# Altium project CAMERA.PrjPcb (part 2 of 3)

## Sheet SDMMC RV1126B.SchDoc: SDMMC0
size A4; DrawnBy: ThanhQuoc; Revision: V01; SheetNumber: 11; SheetTotal: 21; Project: RV1126 CAMERA BOARD DESIGN
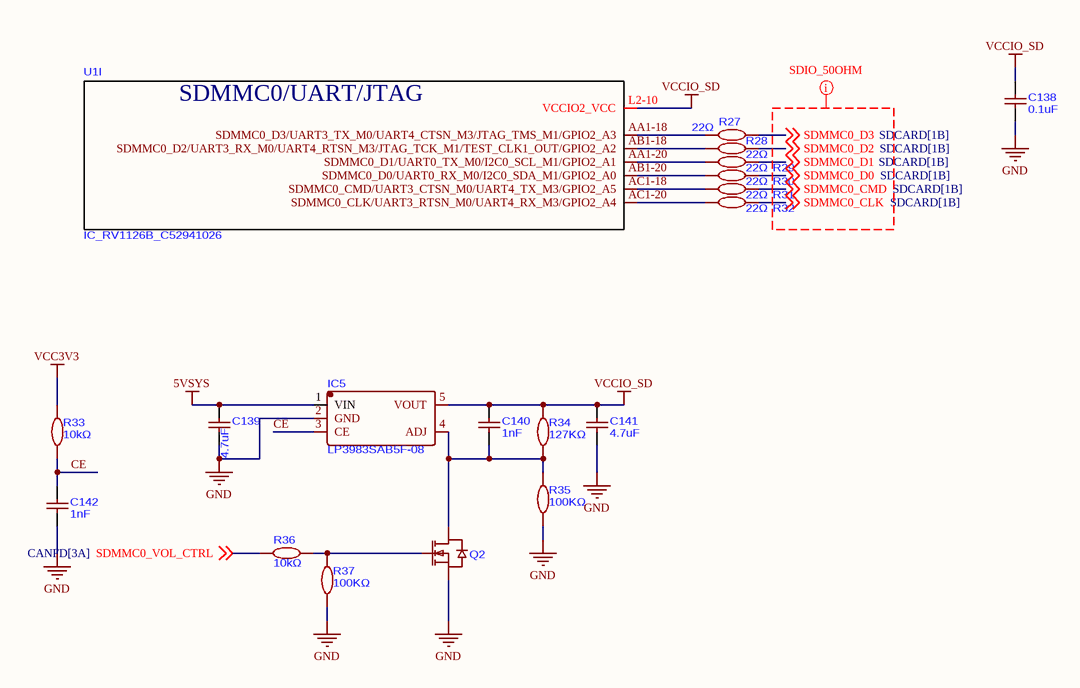
[diagram p10: SDMMC RV1126B.SchDoc]

### Parts
C138  0.1uF  [C0201]
C139  4.7uF  [C0402]
C140  1nF  [C0201]
C141  4.7uF  [C0402]
C142  1nF  [C0201]
IC5  LP3983SAB5F-08  [SOT-23-5_L3.0-W1.7-P0.95-LS2.8-BR]
Q2  N-CHANEL  [SOT-23-3_L2.9-W1.3-P1.90-LS2.4-BR]  (value not drawn)
R27  22Ω  [R0201]
R28  22Ω  [R0201]
R29  22Ω  [R0201]
R30  22Ω  [R0201]
R31  22Ω  [R0201]
R32  22Ω  [R0201]
R33  10kΩ  [R0201]
R34  127KΩ  [R0201]
R35  100KΩ  [R0201]
R36  10kΩ  [R0201]
R37  100KΩ  [R0201]
U1  IC_RV1126B_C52941026  [CCSP-491_L14.0-W14.0-TL_RV1126B]  (part I of 18)

### Nets
5VSYS: C139.2 IC5.1(VIN)
GND: C138.2 C139.1 C141.2 C142.1 IC5.2(GND) Q2.2(S) R35.1 R37.1
VCC3V3: R33.1
VCCIO_SD: C138.1 C140.2 C141.1 IC5.5(VOUT) R34.2 U1.L2-10(VCCIO2_VCC)
CE: C142.2 IC5.3(CE) R33.2
SDMMC0_CLK: R32.2 ; off-sheet SDMMC0_CLK
SDMMC0_CMD: R31.2 ; off-sheet SDMMC0_CMD
SDMMC0_D0: R30.2 ; off-sheet SDMMC0_D0
SDMMC0_D1: R29.2 ; off-sheet SDMMC0_D1
SDMMC0_D2: R28.2 ; off-sheet SDMMC0_D2
SDMMC0_D3: R27.2 ; off-sheet SDMMC0_D3
SDMMC0_VOL_CTRL: R36.1 ; off-sheet SDMMC0_VOL_CTRL
NetC140_1: C140.1 IC5.4(ADJ) Q2.3(D) R34.1 R35.2
NetQ2_1: Q2.1(G) R36.2 R37.2
NetR27_1: R27.1 U1.AA1-18(SDMMC0_D3/UART3_TX_M0/UART4_CTSN_M3/JTAG_TMS_M1/GPIO2_A3)
NetR28_1: R28.1 U1.AB1-18(SDMMC0_D2/UART3_RX_M0/UART4_RTSN_M3/JTAG_TCK_M1/TEST_CLK1_OUT/GPIO2_A2)
NetR29_1: R29.1 U1.AA1-20(SDMMC0_D1/UART0_TX_M0/I2C0_SCL_M1/GPIO2_A1)
NetR30_1: R30.1 U1.AB1-20(SDMMC0_D0/UART0_RX_M0/I2C0_SDA_M1/GPIO2_A0)
NetR31_1: R31.1 U1.AC1-18(SDMMC0_CMD/UART3_CTSN_M0/UART4_TX_M3/GPIO2_A5)
NetR32_1: R32.1 U1.AC1-20(SDMMC0_CLK/UART3_RTSN_M0/UART4_RX_M3/GPIO2_A4)

### Layout directives
net class SDIO_50OHM: SDMMC0_CLK, SDMMC0_CMD, SDMMC0_D0, SDMMC0_D1, SDMMC0_D2, SDMMC0_D3

### Notes on the sheet
- Title:
- Drawn By:
- Page Contents:
- Checked By:
- Size:
- Date:
- File:
- License:
- Email:
- A4
- nguyenthanhquoc0206@gmail.com
- Number:
- Time:
- Revision:
- Sheet
- Website:
- of
- https://www.facebook.com/ntq.687
- (in symbol IC_RV1126B_C52941026, part I) SDMMC0/UART/JTAG

### Library data of the parts
C138 = CAP_100nF-6.3V-10%-0201_1: as C42 on sheet Power Pins Page RV1126
C139 C141 = CAP_4.7uF-16V-10%-0402: 4.7uF ±10% 16V Ceramic Capacitor X5R 0402
C140 C142 = CAP_1nF-50V-10%-0201: CAP CER 1nF 50V X7R 0201
IC5 = LP3983SAB5F-08: 300mA, Ultra-low noise, Small Package Ultra-Fast CMOS LDO Regulator; ComponentLink1Description: LCSC; ComponentLink1URL: https://www.lcsc.com/product-detail/C324567.html?s_z=n_q_LP3983SAB5F-08&spm=wm.fly.bg.0.xh&lcsc_vid=EwRWBFZSQVIPVFdUTlJfVldeFFRYUFQAElRYBFRRE1MxVlNeRVlfX1BQRFFcUTsOAxUeFF5JWBYZEEoKFBINSQcJGk4dAgUUFAk%3D
Q2 = JSM2302A-A2SHB: MOSFET N-CH 20V 3A SOT-23
R27-R32 = RES_22-50mW-1%-0201: RES 22Ω ±1% 50mW 0201; ComponentLink1Description: LCSC; ComponentLink1URL: https://www.lcsc.com/product-detail/C295718.html?s_z=n_q_t_120%2520OHM&spm=wm.fly.bg.5.xh___wm.ssy.tc.1.tz&lcsc_vid=EwRWBFZSQVIPVFdUTlJfVldeFFRYUFQAElRYBFRRE1MxVlNeRFZeU1BfTlBYVzsOAxUeFF5JWBYZEEoKFBINSQcJGk4eFQsCAgIaSgADAwAHC0slRVhcV1ZTT08GEwkK
R33 R36 = RES_10K-50mW-1%-0201: RES 10KΩ ±1% 50mW 0201; ComponentLink1Description: LCSC; ComponentLink1URL: https://www.lcsc.com/product-detail/C93949.html?spm=wm.fly.bg.0.xh&lcsc_vid=EwRWBFZSQVIPVFdUTlJfVldeFFRYUFQAElRYBFRRE1MxVlNeRVlXUFNQQ1RWXjsOAxUeFF5JWBYZEEoKFBINSQcJGk4eFQsCAgIaSgADAwAHC0slRlVYUFFIHxUDCw%3D%3D
R34 = RES_127K-50mW-1%-0201: RES 127kΩ ±1% 50mW 0201; ComponentLink1Description: LCSC; ComponentLink1URL: https://www.lcsc.com/product-detail/C295718.html?s_z=n_q_t_120%2520OHM&spm=wm.fly.bg.5.xh___wm.ssy.tc.1.tz&lcsc_vid=EwRWBFZSQVIPVFdUTlJfVldeFFRYUFQAElRYBFRRE1MxVlNeRFZeU1BfTlBYVzsOAxUeFF5JWBYZEEoKFBINSQcJGk4eFQsCAgIaSgADAwAHC0slRVhcV1ZTT08GEwkK
R35 = RES_100K-50mW-1%-0201: RES 100kΩ ±1% 50mW 0201; ComponentLink1Description: LCSC; ComponentLink1URL: https://www.lcsc.com/product-detail/C295718.html?s_z=n_q_t_120%2520OHM&spm=wm.fly.bg.5.xh___wm.ssy.tc.1.tz&lcsc_vid=EwRWBFZSQVIPVFdUTlJfVldeFFRYUFQAElRYBFRRE1MxVlNeRFZeU1BfTlBYVzsOAxUeFF5JWBYZEEoKFBINSQcJGk4eFQsCAgIaSgADAwAHC0slRVhcV1ZTT08GEwkK
R37 = RES_47K-50mW-1%-0201: 47kΩ 50mW 25V Thick Film Resistor ±1% ±200ppm/℃ 0201 Chip Resistor - Surface Mount RoHS; ComponentLink1Description: LCSC; ComponentLink1URL: https://www.lcsc.com/product-detail/C295718.html?s_z=n_q_t_120%2520OHM&spm=wm.fly.bg.5.xh___wm.ssy.tc.1.tz&lcsc_vid=EwRWBFZSQVIPVFdUTlJfVldeFFRYUFQAElRYBFRRE1MxVlNeRFZeU1BfTlBYVzsOAxUeFF5JWBYZEEoKFBINSQcJGk4eFQsCAgIaSgADAwAHC0slRVhcV1ZTT08GEwkK

## Sheet SDCARD.SchDoc: SD CARD NO BOOT
size A4; DrawnBy: ThanhQuoc; Revision: V01; SheetNumber: 12; SheetTotal: 21; Project: RV1126 CAMERA BOARD DESIGN
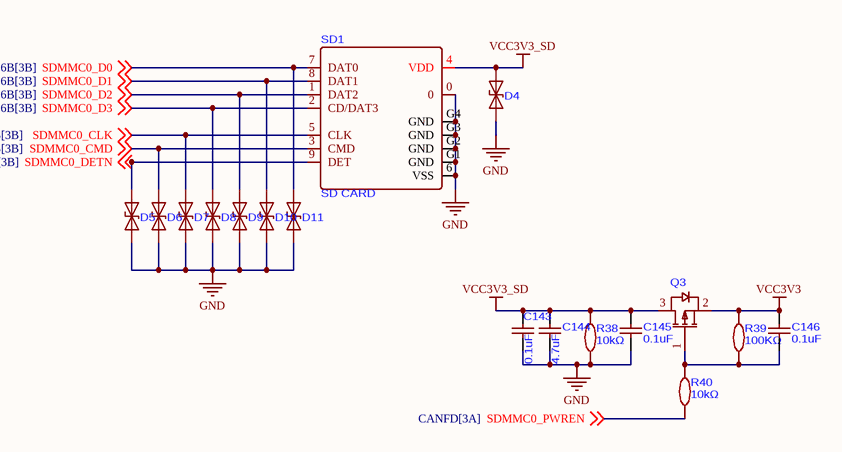
[diagram p11: SDCARD.SchDoc]

### Parts
C143  0.1uF  [C0201]
C144  4.7uF  [C0402]
C145  0.1uF  [C0201]
C146  0.1uF  [C0201]
D4  ESD DIODE  [DSN0603-2_L0.7-W0.3-P0.40-BI]  (value not drawn)
D5  ESD DIODE  [DSN0603-2_L0.7-W0.3-P0.40-BI]  (value not drawn)
D6  ESD DIODE  [DSN0603-2_L0.7-W0.3-P0.40-BI]  (value not drawn)
D7  ESD DIODE  [DSN0603-2_L0.7-W0.3-P0.40-BI]  (value not drawn)
D8  ESD DIODE  [DSN0603-2_L0.7-W0.3-P0.40-BI]  (value not drawn)
D9  ESD DIODE  [DSN0603-2_L0.7-W0.3-P0.40-BI]  (value not drawn)
D10  ESD DIODE  [DSN0603-2_L0.7-W0.3-P0.40-BI]  (value not drawn)
D11  ESD DIODE  [DSN0603-2_L0.7-W0.3-P0.40-BI]  (value not drawn)
Q3  P-CHANNEL  [SOT-23-3_L2.9-W1.3-P1.90-LS2.4-BR]  (value not drawn)
R38  10kΩ  [R0201]
R39  100KΩ  [R0201]
R40  10kΩ  [R0201]
SD1  SD CARD  [CONN-SMD_1051620101]

### Nets
GND: C143.1 C144.1 C145.1 D4.1(K) D5.1(K) D6.1(K) D7.1(K) D8.1(K) D9.1(K) D10.1(K) D11.1(K) R38.1 SD1.0 SD1.6(VSS) SD1.G1(GND) SD1.G2(GND) SD1.G3(GND) SD1.G4(GND)
VCC3V3: C146.2 Q3.2(S) R39.2
VCC3V3_SD: C143.2 C144.2 C145.2 D4.2(A) Q3.3(D) R38.2 SD1.4(VDD)
SDMMC0_CLK: D7.2(A) SD1.5(CLK) ; off-sheet SDMMC0_CLK
SDMMC0_CMD: D6.2(A) SD1.3(CMD) ; off-sheet SDMMC0_CMD
SDMMC0_D0: D11.2(A) SD1.7(DAT0) ; off-sheet SDMMC0_D0
SDMMC0_D1: D10.2(A) SD1.8(DAT1) ; off-sheet SDMMC0_D1
SDMMC0_D2: D9.2(A) SD1.1(DAT2) ; off-sheet SDMMC0_D2
SDMMC0_D3: D8.2(A) SD1.2(CD/DAT3) ; off-sheet SDMMC0_D3
SDMMC0_DETN: D5.2(A) SD1.9(DET) ; off-sheet SDMMC0_DETN
SDMMC0_PWREN: R40.1 ; off-sheet SDMMC0_PWREN
NetC146_1: C146.1 Q3.1(G) R39.1 R40.2

### Notes on the sheet
- Title:
- Drawn By:
- Page Contents:
- Checked By:
- Size:
- Date:
- File:
- License:
- Email:
- A4
- nguyenthanhquoc0206@gmail.com
- Number:
- Time:
- Revision:
- Sheet
- Website:
- of
- https://www.facebook.com/ntq.687

### Library data of the parts
C143 C145 C146 = CAP_100nF-6.3V-10%-0201_1: as C42 on sheet Power Pins Page RV1126
C144 = CAP_4.7uF-16V-10%-0402: as C139 on sheet SDMMC RV1126B
D4-D11 = PESD5V0H1BSFYL: ESD DIODE 5VWM 5VC DSN0603-2 0.13PF
Q3 = WPM3407-3/TR: MOSFET P-CH 30V 4.4A SOT-23
R38 R40 = RES_10K-50mW-1%-0201: RES 10KΩ ±1% 50mW 0201; ComponentLink1Description: LCSC; ComponentLink1URL: https://www.lcsc.com/product-detail/C93949.html?spm=wm.fly.bg.0.xh&lcsc_vid=EwRWBFZSQVIPVFdUTlJfVldeFFRYUFQAElRYBFRRE1MxVlNeRVlXUFNQQ1RWXjsOAxUeFF5JWBYZEEoKFBINSQcJGk4eFQsCAgIaSgADAwAHC0slRlVYUFFIHxUDCw%3D%3D
R39 = RES_100K-50mW-1%-0201: RES 100kΩ ±1% 50mW 0201; ComponentLink1Description: LCSC; ComponentLink1URL: https://www.lcsc.com/product-detail/C295718.html?s_z=n_q_t_120%2520OHM&spm=wm.fly.bg.5.xh___wm.ssy.tc.1.tz&lcsc_vid=EwRWBFZSQVIPVFdUTlJfVldeFFRYUFQAElRYBFRRE1MxVlNeRFZeU1BfTlBYVzsOAxUeFF5JWBYZEEoKFBINSQcJGk4eFQsCAgIaSgADAwAHC0slRVhcV1ZTT08GEwkK
SD1 = 1051620001: CONN MICRO SD CARD (TF CARD)

## Sheet SDMMC1.SchDoc: SDMMC1
size A4; DrawnBy: ThanhQuoc; Revision: V01; SheetNumber: 13; SheetTotal: 21; Project: RV1126 CAMERA BOARD DESIGN
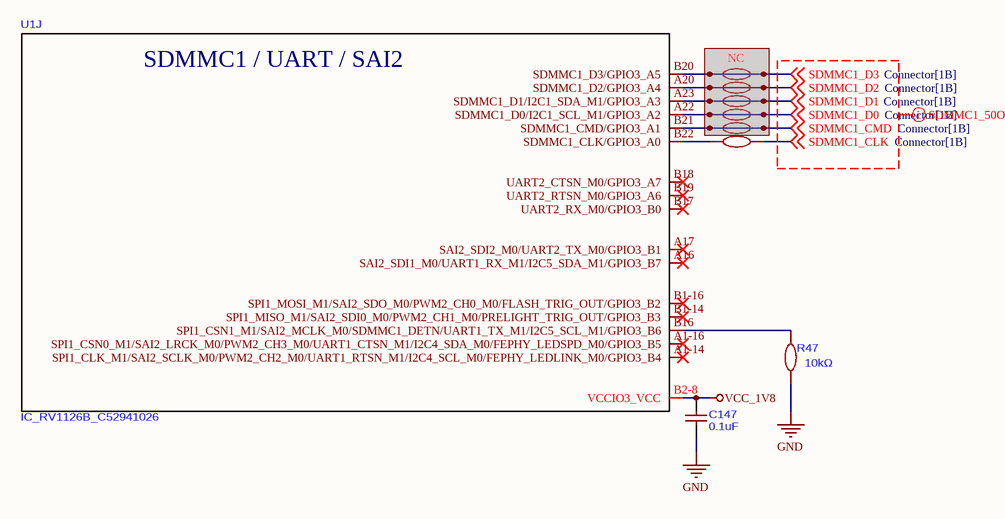
[diagram p12: SDMMC1.SchDoc]

### Parts
C147  0.1uF  [C0201]
R41  22Ω  [R0201]  (value not drawn)  (masked out: inside a compile mask, not in the netlist)
R42  22Ω  [R0201]  (value not drawn)  (masked out: inside a compile mask, not in the netlist)
R43  22Ω  [R0201]  (value not drawn)  (masked out: inside a compile mask, not in the netlist)
R44  22Ω  [R0201]  (value not drawn)  (masked out: inside a compile mask, not in the netlist)
R45  22Ω  [R0201]  (value not drawn)  (masked out: inside a compile mask, not in the netlist)
R46  22Ω  [R0201]  (value not drawn)
R47  10kΩ  [R0201]
U1  IC_RV1126B_C52941026  [CCSP-491_L14.0-W14.0-TL_RV1126B]  (part J of 18)

### Nets
GND: C147.1 R47.1
VCC_1V8: C147.2 U1.B2-8(VCCIO3_VCC)
SDMMC1_CLK: R46.2 ; off-sheet SDMMC1_CLK
NetR46_1: R46.1 U1.B22(SDMMC1_CLK/GPIO3_A0)
NetR47_2: R47.2 U1.B16(SPI1_CSN1_M1/SAI2_MCLK_M0/SDMMC1_DETN/UART1_TX_M1/I2C5_SCL_M1/GPIO3_B6)

Not connected (* = marked no-connect by the designer): U1 A1-14(SPI1_CLK_M1/SAI2_SCLK_M0/PWM2_CH2_M0/UART1_RTSN_M1/I2C4_SCL_M0/FEPHY_LEDLINK_M0/GPIO3_B4)* A1-16(SPI1_CSN0_M1/SAI2_LRCK_M0/PWM2_CH3_M0/UART1_CTSN_M1/I2C4_SDA_M0/FEPHY_LEDSPD_M0/GPIO3_B5)* A16(SAI2_SDI1_M0/UART1_RX_M1/I2C5_SDA_M1/GPIO3_B7)* A17(SAI2_SDI2_M0/UART2_TX_M0/GPIO3_B1)* A20(SDMMC1_D2/GPIO3_A4) A22(SDMMC1_D0/I2C1_SCL_M1/GPIO3_A2) A23(SDMMC1_D1/I2C1_SDA_M1/GPIO3_A3) B1-14(SPI1_MISO_M1/SAI2_SDI0_M0/PWM2_CH1_M0/PRELIGHT_TRIG_OUT/GPIO3_B3)* B1-16(SPI1_MOSI_M1/SAI2_SDO_M0/PWM2_CH0_M0/FLASH_TRIG_OUT/GPIO3_B2)* B17(UART2_RX_M0/GPIO3_B0)* B18(UART2_CTSN_M0/GPIO3_A7)* B19(UART2_RTSN_M0/GPIO3_A6)* B20(SDMMC1_D3/GPIO3_A5) B21(SDMMC1_CMD/GPIO3_A1)

### Layout directives
net class SDMMC1_50OHM: SDMMC1_CLK, SDMMC1_CMD, SDMMC1_D0, SDMMC1_D1, SDMMC1_D2, SDMMC1_D3

### Notes on the sheet
- (near R41) NC
- Title:
- Drawn By:
- Page Contents:
- Checked By:
- Size:
- Date:
- File:
- License:
- Email:
- A4
- nguyenthanhquoc0206@gmail.com
- Number:
- Time:
- Revision:
- Sheet
- Website:
- of
- https://www.facebook.com/ntq.687
- (in symbol IC_RV1126B_C52941026, part J) SDMMC1 / UART / SAI2

### Library data of the parts
C147 = CAP_100nF-6.3V-10%-0201_1: as C42 on sheet Power Pins Page RV1126
R41-R46 = RES_22-50mW-1%-0201: RES 22Ω ±1% 50mW 0201; ComponentLink1Description: LCSC; ComponentLink1URL: https://www.lcsc.com/product-detail/C295718.html?s_z=n_q_t_120%2520OHM&spm=wm.fly.bg.5.xh___wm.ssy.tc.1.tz&lcsc_vid=EwRWBFZSQVIPVFdUTlJfVldeFFRYUFQAElRYBFRRE1MxVlNeRFZeU1BfTlBYVzsOAxUeFF5JWBYZEEoKFBINSQcJGk4eFQsCAgIaSgADAwAHC0slRVhcV1ZTT08GEwkK
R47 = RES_10K-50mW-1%-0201: RES 10KΩ ±1% 50mW 0201; ComponentLink1Description: LCSC; ComponentLink1URL: https://www.lcsc.com/product-detail/C93949.html?spm=wm.fly.bg.0.xh&lcsc_vid=EwRWBFZSQVIPVFdUTlJfVldeFFRYUFQAElRYBFRRE1MxVlNeRVlXUFNQQ1RWXjsOAxUeFF5JWBYZEEoKFBINSQcJGk4eFQsCAgIaSgADAwAHC0slRlVYUFFIHxUDCw%3D%3D

## Sheet SARADC.SchDoc: SARADC
size A4; DrawnBy: ThanhQuoc; Revision: V01; SheetNumber: 14; SheetTotal: 21; Project: RV1126 CAMERA BOARD DESIGN; SPICEModelCacheTSUQRNIG: <root> / <DocumentId>TSUQRNIG</DocumentId> / <CacheFrame Number="0"> / <Model Name="fb_220_adv" Kind="CKT"> / <Text>.SUBCKT FB_220_ADV 1 2 / Rdc 1 2 0.045 / * low freq inductive / L1 1 3 50n / R1 3 2 1 / * high freq loss / R2 1 2 200 / Cpar 1 2 2p / .ends FB_220_ADV</Text> / </Model> / </CacheFrame> / </root>
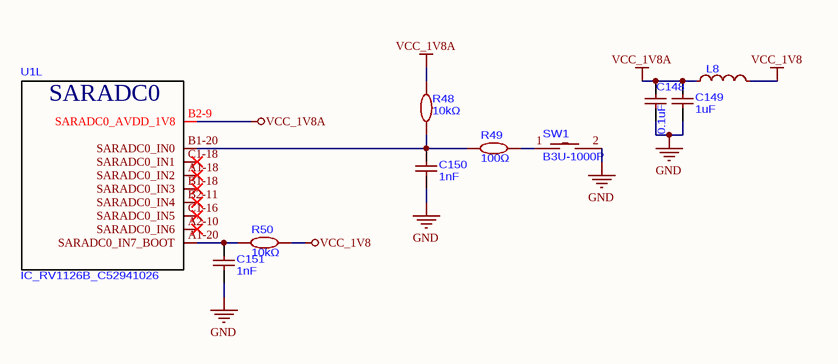
[diagram p13: SARADC.SchDoc]

### Parts
C148  0.1uF  [C0201]
C149  1uF  [C0201]
C150  1nF  [C0201]
C151  1nF  [C0201]
L8  FERRITE BEAD 120Ω 0201 1LN  [R0201]  (value not drawn)
R48  10kΩ  [R0201]
R49  100Ω  [R0201]
R50  10kΩ  [R0201]
SW1  B3U-1000P  [KEY-SMD_B3U-1000PM]
U1  IC_RV1126B_C52941026  [CCSP-491_L14.0-W14.0-TL_RV1126B]  (part L of 18)

### Nets
GND: C148.1 C149.2 C150.1 C151.1 SW1.2
VCC_1V8: L8.2 R50.1
VCC_1V8A: C148.2 C149.1 L8.1 R48.2 U1.B2-9(SARADC0_AVDD_1V8)
NetC150_2: C150.2 R48.1 R49.1 U1.B1-20(SARADC0_IN0)
NetC151_2: C151.2 R50.2 U1.A1-20(SARADC0_IN7_BOOT)
NetR49_2: R49.2 SW1.1

Not connected (* = marked no-connect by the designer): U1 A1-18(SARADC0_IN2)* A2-10(SARADC0_IN6)* B1-18(SARADC0_IN3)* B2-11(SARADC0_IN4)* C1-16(SARADC0_IN5)* C1-18(SARADC0_IN1)*

### Notes on the sheet
- Title:
- Drawn By:
- Page Contents:
- Checked By:
- Size:
- Date:
- File:
- License:
- Email:
- A4
- nguyenthanhquoc0206@gmail.com
- Number:
- Time:
- Revision:
- Sheet
- Website:
- of
- https://www.facebook.com/ntq.687
- (in symbol IC_RV1126B_C52941026, part L) SARADC0

### Library data of the parts
C148 = CAP_100nF-6.3V-10%-0201_1: as C42 on sheet Power Pins Page RV1126
C149 = CAP_1uF-6.3V-10%-0201: 1uF ±10% 6.3V Ceramic Capacitor X5R 0201
C150 C151 = CAP_1nF-50V-10%-0201: CAP CER 1nF 50V X7R 0201
L8 = MPZ0603S121HT000: 120 Ohms @ 100MHz 1 Power Line Ferrite Bead 0201 1A 130mOhm
R48 R50 = RES_10K-50mW-1%-0201: RES 10KΩ ±1% 50mW 0201; ComponentLink1Description: LCSC; ComponentLink1URL: https://www.lcsc.com/product-detail/C93949.html?spm=wm.fly.bg.0.xh&lcsc_vid=EwRWBFZSQVIPVFdUTlJfVldeFFRYUFQAElRYBFRRE1MxVlNeRVlXUFNQQ1RWXjsOAxUeFF5JWBYZEEoKFBINSQcJGk4eFQsCAgIaSgADAwAHC0slRlVYUFFIHxUDCw%3D%3D
R49 = RES_100OHM-50mW-1%-0201: RES 100Ω ±1% 50mW 0201
SW1 = B3U-1000P: 12V 2.5mm Round Button 3mm SPST 50mA SMD,3x2.5mm Tactile Switches ROHS

## Sheet USB 2.0 CONTROLLER.SchDoc: USB 2.0 CONTROLLER
size A4; DrawnBy: ThanhQuoc; Revision: V01; SheetNumber: 15; SheetTotal: 21; Project: RV1126 CAMERA BOARD DESIGN
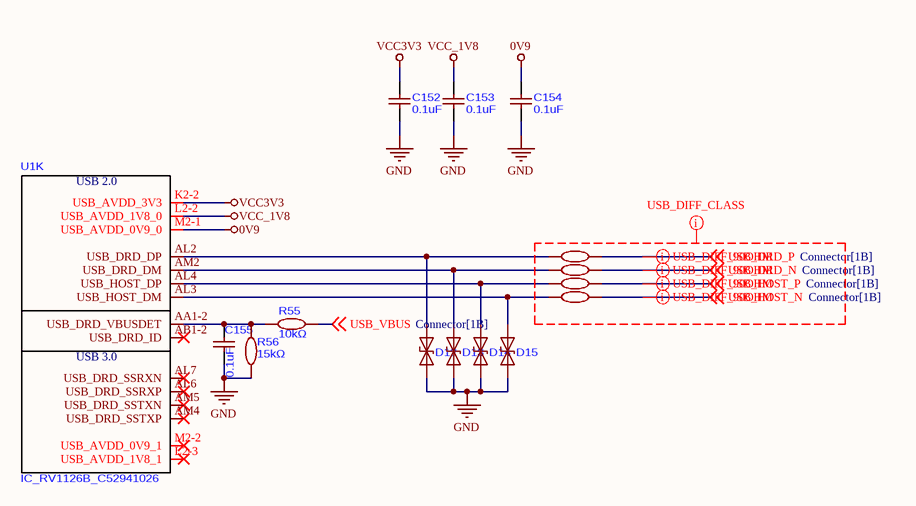
[diagram p14: USB 2.0 CONTROLLER.SchDoc]

### Parts
C152  0.1uF  [C0201]
C153  0.1uF  [C0201]
C154  0.1uF  [C0201]
C155  0.1uF  [C0201]
D12  ESD DIODE  [DSN0603-2_L0.7-W0.3-P0.40-BI]  (value not drawn)
D13  ESD DIODE  [DSN0603-2_L0.7-W0.3-P0.40-BI]  (value not drawn)
D14  ESD DIODE  [DSN0603-2_L0.7-W0.3-P0.40-BI]  (value not drawn)
D15  ESD DIODE  [DSN0603-2_L0.7-W0.3-P0.40-BI]  (value not drawn)
R51  2.2Ω  [R0201]  (value not drawn)
R52  2.2Ω  [R0201]  (value not drawn)
R53  2.2Ω  [R0201]  (value not drawn)
R54  2.2Ω  [R0201]  (value not drawn)
R55  10kΩ  [R0201]
R56  15kΩ  [R0201]
U1  IC_RV1126B_C52941026  [CCSP-491_L14.0-W14.0-TL_RV1126B]  (part K of 18)

### Nets
0V9: C154.2 U1.M2-1(USB_AVDD_0V9_0)
GND: C152.1 C153.1 C154.1 C155.1 D12.1(K) D13.1(K) D14.1(K) D15.1(K) R56.1
VCC3V3: C152.2 U1.K2-2(USB_AVDD_3V3)
VCC_1V8: C153.2 U1.L2-2(USB_AVDD_1V8_0)
USB_DRD_N: R52.2 ; off-sheet USB_DRD_N
USB_DRD_P: R51.2 ; off-sheet USB_DRD_P
USB_HOST_N: R54.2 ; off-sheet USB_HOST_N
USB_HOST_P: R53.2 ; off-sheet USB_HOST_P
USB_VBUS: R55.2 ; off-sheet USB_VBUS
NetC155_2: C155.2 R55.1 R56.2 U1.AA1-2(USB_DRD_VBUSDET)
NetD12_2: D12.2(A) R51.1 U1.AL2(USB_DRD_DP)
NetD13_2: D13.2(A) R52.1 U1.AM2(USB_DRD_DM)
NetD14_2: D14.2(A) R53.1 U1.AL4(USB_HOST_DP)
NetD15_2: D15.2(A) R54.1 U1.AL3(USB_HOST_DM)

Not connected (* = marked no-connect by the designer): U1 AB1-2(USB_DRD_ID)* AL6(USB_DRD_SSRXP)* AL7(USB_DRD_SSRXN)* AM4(USB_DRD_SSTXP)* AM5(USB_DRD_SSTXN)* L2-3(USB_AVDD_1V8_1)* M2-2(USB_AVDD_0V9_1)*

### Layout directives
net class USB_DIFF_CLASS: USB_DRD_N, USB_DRD_P, USB_HOST_N, USB_HOST_P
differential pair; differential pair class USB_DIFF_90OHM: USB_DRD_N, USB_DRD_P, USB_HOST_N, USB_HOST_P

### Notes on the sheet
- Title:
- Drawn By:
- Page Contents:
- Checked By:
- Size:
- Date:
- File:
- License:
- Email:
- A4
- nguyenthanhquoc0206@gmail.com
- Number:
- Time:
- Revision:
- Sheet
- Website:
- of
- https://www.facebook.com/ntq.687
- (in symbol IC_RV1126B_C52941026, part K) USB 2.0; USB 3.0

### Library data of the parts
C152-C155 = CAP_100nF-6.3V-10%-0201_1: as C42 on sheet Power Pins Page RV1126
D12-D15 = PESD5V0H1BSFYL: ESD DIODE 5VWM 5VC DSN0603-2 0.13PF
R51-R54 = RES_2.2-50mW-1%-0201: RES 2.2Ω ±1% 50mW 0201; ComponentLink1Description: LCSC; ComponentLink1URL: https://www.lcsc.com/product-detail/C295718.html?s_z=n_q_t_120%2520OHM&spm=wm.fly.bg.5.xh___wm.ssy.tc.1.tz&lcsc_vid=EwRWBFZSQVIPVFdUTlJfVldeFFRYUFQAElRYBFRRE1MxVlNeRFZeU1BfTlBYVzsOAxUeFF5JWBYZEEoKFBINSQcJGk4eFQsCAgIaSgADAwAHC0slRVhcV1ZTT08GEwkK
R55 = RES_10K-50mW-1%-0201: RES 10KΩ ±1% 50mW 0201; ComponentLink1Description: LCSC; ComponentLink1URL: https://www.lcsc.com/product-detail/C93949.html?spm=wm.fly.bg.0.xh&lcsc_vid=EwRWBFZSQVIPVFdUTlJfVldeFFRYUFQAElRYBFRRE1MxVlNeRVlXUFNQQ1RWXjsOAxUeFF5JWBYZEEoKFBINSQcJGk4eFQsCAgIaSgADAwAHC0slRlVYUFFIHxUDCw%3D%3D
R56 = RES_15K-0.05W-1%-0201: RES 15kΩ ±1% 50mW 0201

## Sheet CANFD.SchDoc: CANFD OF CPU
size A4; DrawnBy: ThanhQuoc; Revision: V01; SheetNumber: 16; SheetTotal: 21; Project: RV1126 CAMERA BOARD DESIGN
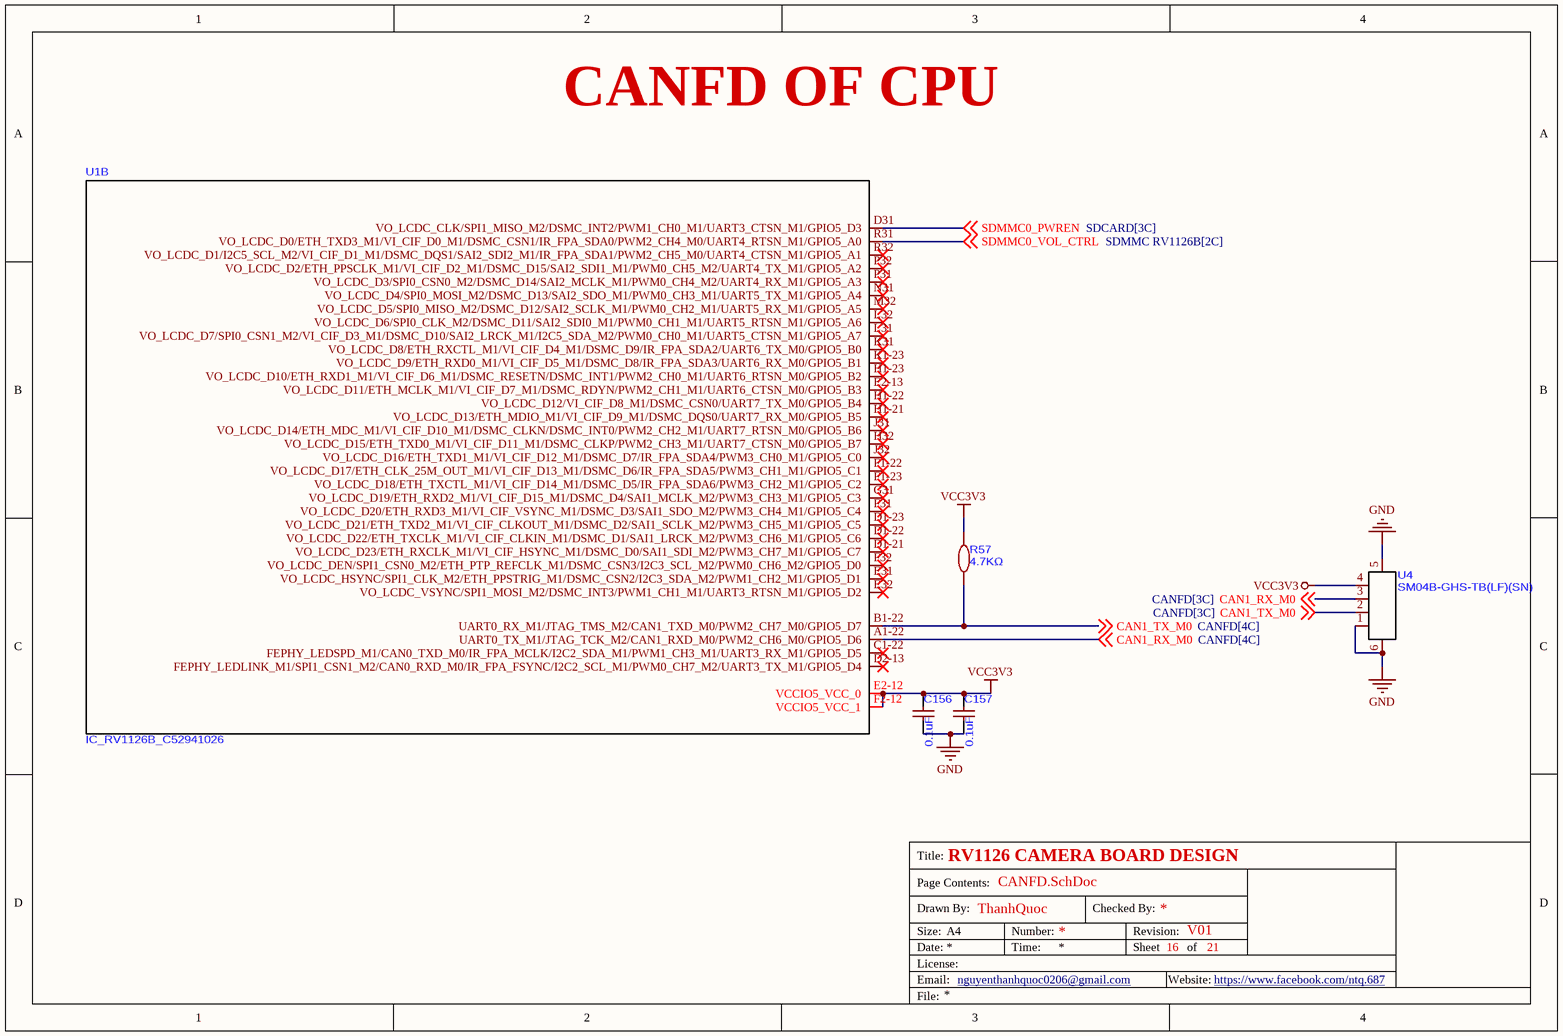
[diagram p15: CANFD.SchDoc]

### Parts
C156  0.1uF  [C0201]
C157  0.1uF  [C0201]
R57  4.7KΩ  [R0201]
U1  IC_RV1126B_C52941026  [CCSP-491_L14.0-W14.0-TL_RV1126B]  (part B of 18)
U4  SM04B-GHS-TB(LF)(SN)  [CONN-SMD_4P-P1.25_SM04B-GHS-TB-LF-SN]

### Nets
GND: C156.1 C157.1 U4.1 U4.5 U4.6
VCC3V3: C156.2 C157.2 R57.2 U1.E2-12(VCCIO5_VCC_0) U1.F2-12(VCCIO5_VCC_1) U4.4
CAN1_RX_M0: U1.A1-22(UART0_TX_M1/JTAG_TCK_M2/CAN1_RXD_M0/PWM2_CH6_M0/GPIO5_D6) U4.3 ; off-sheet CAN1_RX_M0
CAN1_TX_M0: R57.1 U1.B1-22(UART0_RX_M1/JTAG_TMS_M2/CAN1_TXD_M0/PWM2_CH7_M0/GPIO5_D7) U4.2 ; off-sheet CAN1_TX_M0
SDMMC0_PWREN: U1.D31(VO_LCDC_CLK/SPI1_MISO_M2/DSMC_INT2/PWM1_CH0_M1/UART3_CTSN_M1/GPIO5_D3) ; off-sheet SDMMC0_PWREN
SDMMC0_VOL_CTRL: U1.R31(VO_LCDC_D0/ETH_TXD3_M1/VI_CIF_D0_M1/DSMC_CSN1/IR_FPA_SDA0/PWM2_CH4_M0/UART4_RTSN_M1/GPIO5_A0) ; off-sheet SDMMC0_VOL_CTRL

Not connected (* = marked no-connect by the designer): U1 C1-22(FEPHY_LEDSPD_M1/CAN0_TXD_M0/IR_FPA_MCLK/I2C2_SDA_M1/PWM1_CH3_M1/UART3_RX_M1/GPIO5_D5)* D1-21(VO_LCDC_D23/ETH_RXCLK_M1/VI_CIF_HSYNC_M1/DSMC_D0/SAI1_SDI_M2/PWM3_CH7_M1/GPIO5_C7)* D1-22(VO_LCDC_D22/ETH_TXCLK_M1/VI_CIF_CLKIN_M1/DSMC_D1/SAI1_LRCK_M2/PWM3_CH6_M1/GPIO5_C6)* D1-23(VO_LCDC_D21/ETH_TXD2_M1/VI_CIF_CLKOUT_M1/DSMC_D2/SAI1_SCLK_M2/PWM3_CH5_M1/GPIO5_C5)* D2-13(FEPHY_LEDLINK_M1/SPI1_CSN1_M2/CAN0_RXD_M0/IR_FPA_FSYNC/I2C2_SCL_M1/PWM0_CH7_M2/UART3_TX_M1/GPIO5_D4)* E2-13(VO_LCDC_D11/ETH_MCLK_M1/VI_CIF_D7_M1/DSMC_RDYN/PWM2_CH1_M1/UART6_CTSN_M0/GPIO5_B3)* E31(VO_LCDC_HSYNC/SPI1_CLK_M2/ETH_PPSTRIG_M1/DSMC_CSN2/I2C3_SDA_M2/PWM1_CH2_M1/GPIO5_D1)* E32(VO_LCDC_VSYNC/SPI1_MOSI_M2/DSMC_INT3/PWM1_CH1_M1/UART3_RTSN_M1/GPIO5_D2)* F1-22(VO_LCDC_D17/ETH_CLK_25M_OUT_M1/VI_CIF_D13_M1/DSMC_D6/IR_FPA_SDA5/PWM3_CH1_M1/GPIO5_C1)* F1-23(VO_LCDC_D18/ETH_TXCTL_M1/VI_CIF_D14_M1/DSMC_D5/IR_FPA_SDA6/PWM3_CH2_M1/GPIO5_C2)* F31(VO_LCDC_D20/ETH_RXD3_M1/VI_CIF_VSYNC_M1/DSMC_D3/SAI1_SDO_M2/PWM3_CH4_M1/GPIO5_C4)* F32(VO_LCDC_DEN/SPI1_CSN0_M2/ETH_PTP_REFCLK_M1/DSMC_CSN3/I2C3_SCL_M2/PWM0_CH6_M2/GPIO5_D0)* G31(VO_LCDC_D19/ETH_RXD2_M1/VI_CIF_D15_M1/DSMC_D4/SAI1_MCLK_M2/PWM3_CH3_M1/GPIO5_C3)* H1-21(VO_LCDC_D13/ETH_MDIO_M1/VI_CIF_D9_M1/DSMC_DQS0/UART7_RX_M0/GPIO5_B5)* H1-22(VO_LCDC_D12/VI_CIF_D8_M1/DSMC_CSN0/UART7_TX_M0/GPIO5_B4)* H1-23(VO_LCDC_D10/ETH_RXD1_M1/VI_CIF_D6_M1/DSMC_RESETN/DSMC_INT1/PWM2_CH0_M1/UART6_RTSN_M0/GPIO5_B2)* H32(VO_LCDC_D15/ETH_TXD0_M1/VI_CIF_D11_M1/DSMC_CLKP/PWM2_CH3_M1/UART7_CTSN_M0/GPIO5_B7)* J31(VO_LCDC_D14/ETH_MDC_M1/VI_CIF_D10_M1/DSMC_CLKN/DSMC_INT0/PWM2_CH2_M1/UART7_RTSN_M0/GPIO5_B6)* J32(VO_LCDC_D16/ETH_TXD1_M1/VI_CIF_D12_M1/DSMC_D7/IR_FPA_SDA4/PWM3_CH0_M1/GPIO5_C0)* K1-23(VO_LCDC_D9/ETH_RXD0_M1/VI_CIF_D5_M1/DSMC_D8/IR_FPA_SDA3/UART6_RX_M0/GPIO5_B1)* K31(VO_LCDC_D8/ETH_RXCTL_M1/VI_CIF_D4_M1/DSMC_D9/IR_FPA_SDA2/UART6_TX_M0/GPIO5_B0)* L31(VO_LCDC_D7/SPI0_CSN1_M2/VI_CIF_D3_M1/DSMC_D10/SAI2_LRCK_M1/I2C5_SDA_M2/PWM0_CH0_M1/UART5_CTSN_M1/GPIO5_A7)* L32(VO_LCDC_D6/SPI0_CLK_M2/DSMC_D11/SAI2_SDI0_M1/PWM0_CH1_M1/UART5_RTSN_M1/GPIO5_A6)* M32(VO_LCDC_D5/SPI0_MISO_M2/DSMC_D12/SAI2_SCLK_M1/PWM0_CH2_M1/UART5_RX_M1/GPIO5_A5)* N31(VO_LCDC_D4/SPI0_MOSI_M2/DSMC_D13/SAI2_SDO_M1/PWM0_CH3_M1/UART5_TX_M1/GPIO5_A4)* P31(VO_LCDC_D3/SPI0_CSN0_M2/DSMC_D14/SAI2_MCLK_M1/PWM0_CH4_M2/UART4_RX_M1/GPIO5_A3)* P32(VO_LCDC_D2/ETH_PPSCLK_M1/VI_CIF_D2_M1/DSMC_D15/SAI2_SDI1_M1/PWM0_CH5_M2/UART4_TX_M1/GPIO5_A2)* R32(VO_LCDC_D1/I2C5_SCL_M2/VI_CIF_D1_M1/DSMC_DQS1/SAI2_SDI2_M1/IR_FPA_SDA1/PWM2_CH5_M0/UART4_CTSN_M1/GPIO5_A1)*

### Notes on the sheet
- Title:
- Drawn By:
- Page Contents:
- Checked By:
- Size:
- Date:
- File:
- License:
- Email:
- A4
- nguyenthanhquoc0206@gmail.com
- Number:
- Time:
- Revision:
- Sheet
- Website:
- of
- https://www.facebook.com/ntq.687

### Library data of the parts
C156 C157 = CAP_100nF-6.3V-10%-0201_1: 0.1uF ±10% 6.3V Ceramic Capacitor X5R 0201
R57 = RES_4.7K-50mW-1%-0201: RES 4.7kΩ ±1% 50mW 0201; ComponentLink1Description: LCSC; ComponentLink1URL: https://www.lcsc.com/product-detail/C295718.html?s_z=n_q_t_120%2520OHM&spm=wm.fly.bg.5.xh___wm.ssy.tc.1.tz&lcsc_vid=EwRWBFZSQVIPVFdUTlJfVldeFFRYUFQAElRYBFRRE1MxVlNeRFZeU1BfTlBYVzsOAxUeFF5JWBYZEEoKFBINSQcJGk4eFQsCAgIaSgADAwAHC0slRVhcV1ZTT08GEwkK
U4 = SM04B-GHS-TB(LF)(SN): CONN HEADER SMD R/A 4POS 1.25mm

## Sheet MIPI_CSI.SchDoc: MIPI CSI CAM
size A4; DrawnBy: ThanhQuoc; Revision: V01; SheetNumber: 17; SheetTotal: 21; Project: RV1126 CAMERA BOARD DESIGN
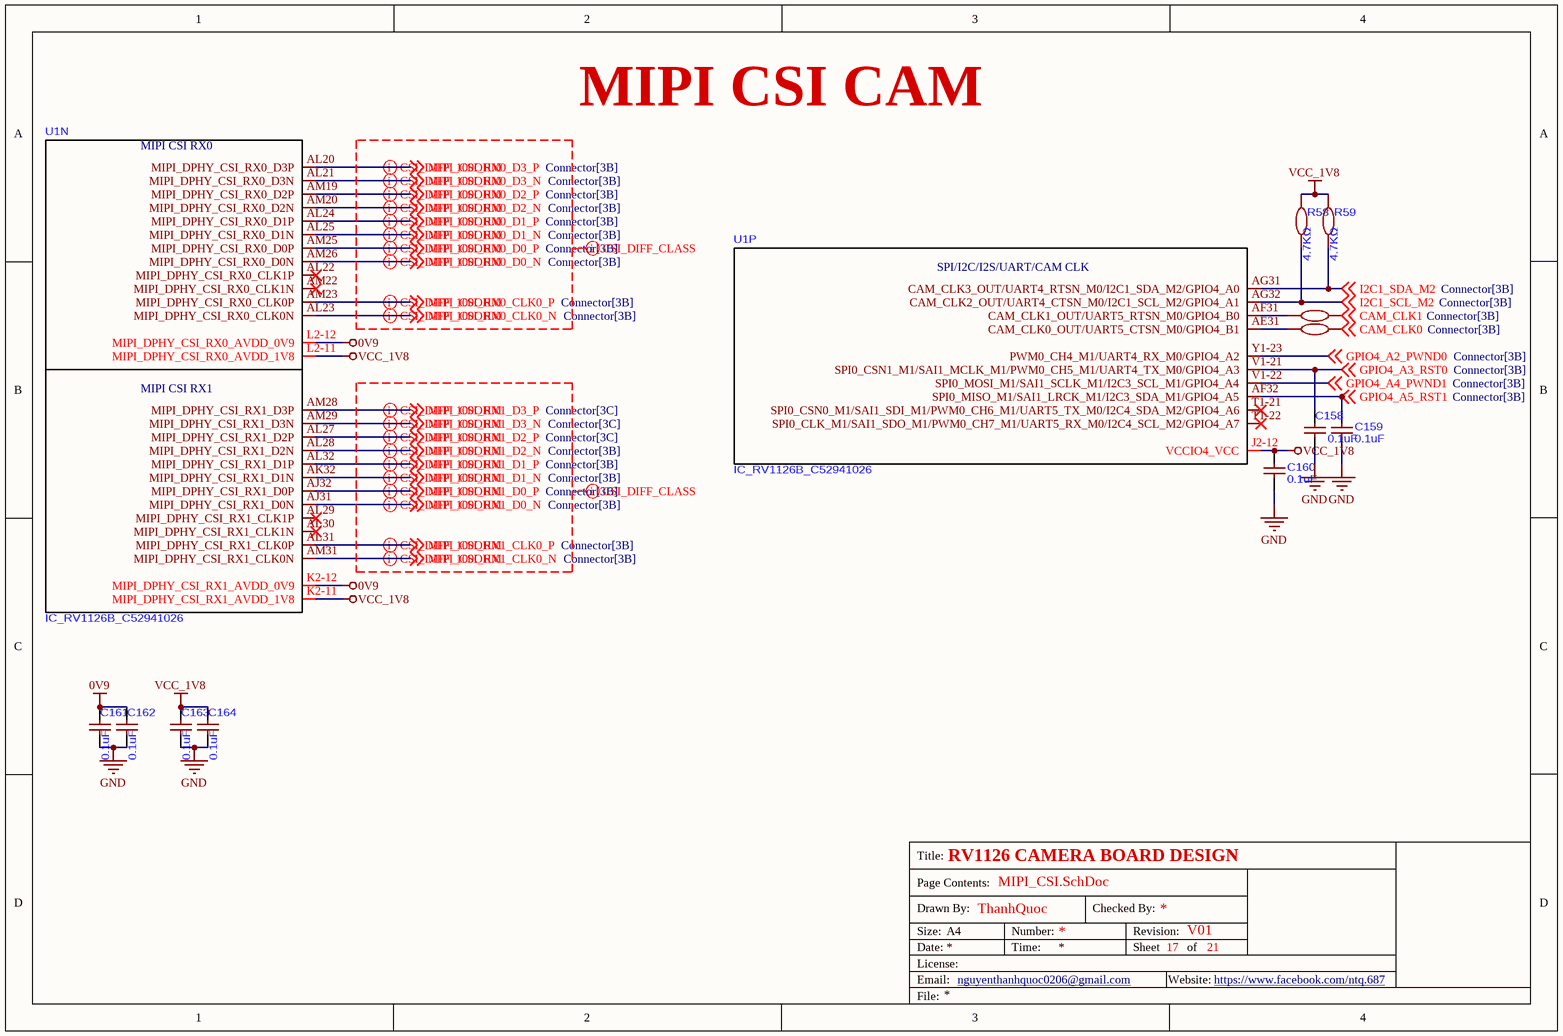
[diagram p16: MIPI_CSI.SchDoc]

### Parts
C158  0.1uF  [C0201]
C159  0.1uF  [C0201]
C160  0.1uF  [C0201]
C161  0.1uF  [C0201]
C162  0.1uF  [C0201]
C163  0.1uF  [C0201]
C164  0.1uF  [C0201]
R58  4.7KΩ  [R0201]
R59  4.7KΩ  [R0201]
R60  22Ω  [R0201]  (value not drawn)
R61  22Ω  [R0201]  (value not drawn)
U1  IC_RV1126B_C52941026  [CCSP-491_L14.0-W14.0-TL_RV1126B]  (parts N,P of 18)

### Nets
0V9: C161.2 C162.2 U1.K2-12(MIPI_DPHY_CSI_RX1_AVDD_0V9) U1.L2-12(MIPI_DPHY_CSI_RX0_AVDD_0V9)
GND: C158.1 C159.1 C160.1 C161.1 C162.1 C163.1 C164.1
VCC_1V8: C160.2 C163.2 C164.2 R58.2 R59.2 U1.J2-12(VCCIO4_VCC) U1.K2-11(MIPI_DPHY_CSI_RX1_AVDD_1V8) U1.L2-11(MIPI_DPHY_CSI_RX0_AVDD_1V8)
CAM_CLK0: R61.2 ; off-sheet CAM_CLK0
CAM_CLK1: R60.2 ; off-sheet CAM_CLK1
GPIO4_A2_PWND0: U1.Y1-23(PWM0_CH4_M1/UART4_RX_M0/GPIO4_A2) ; off-sheet GPIO4_A2_PWND0
GPIO4_A3_RST0: C158.2 U1.V1-21(SPI0_CSN1_M1/SAI1_MCLK_M1/PWM0_CH5_M1/UART4_TX_M0/GPIO4_A3) ; off-sheet GPIO4_A3_RST0
GPIO4_A4_PWND1: U1.V1-22(SPI0_MOSI_M1/SAI1_SCLK_M1/I2C3_SCL_M1/GPIO4_A4) ; off-sheet GPIO4_A4_PWND1
GPIO4_A5_RST1: C159.2 U1.AF32(SPI0_MISO_M1/SAI1_LRCK_M1/I2C3_SDA_M1/GPIO4_A5) ; off-sheet GPIO4_A5_RST1
I2C1_SCL_M2: R58.1 U1.AG32(CAM_CLK2_OUT/UART4_CTSN_M0/I2C1_SCL_M2/GPIO4_A1) ; off-sheet I2C1_SCL_M2
I2C1_SDA_M2: R59.1 U1.AG31(CAM_CLK3_OUT/UART4_RTSN_M0/I2C1_SDA_M2/GPIO4_A0) ; off-sheet I2C1_SDA_M2
MIPI_CSI_RX0_CLK0_N: U1.AL23(MIPI_DPHY_CSI_RX0_CLK0N) ; off-sheet MIPI_CSI_RX0_CLK0_N
MIPI_CSI_RX0_CLK0_P: U1.AM23(MIPI_DPHY_CSI_RX0_CLK0P) ; off-sheet MIPI_CSI_RX0_CLK0_P
MIPI_CSI_RX0_D0_N: U1.AM26(MIPI_DPHY_CSI_RX0_D0N) ; off-sheet MIPI_CSI_RX0_D0_N
MIPI_CSI_RX0_D0_P: U1.AM25(MIPI_DPHY_CSI_RX0_D0P) ; off-sheet MIPI_CSI_RX0_D0_P
MIPI_CSI_RX0_D1_N: U1.AL25(MIPI_DPHY_CSI_RX0_D1N) ; off-sheet MIPI_CSI_RX0_D1_N
MIPI_CSI_RX0_D1_P: U1.AL24(MIPI_DPHY_CSI_RX0_D1P) ; off-sheet MIPI_CSI_RX0_D1_P
MIPI_CSI_RX0_D2_N: U1.AM20(MIPI_DPHY_CSI_RX0_D2N) ; off-sheet MIPI_CSI_RX0_D2_N
MIPI_CSI_RX0_D2_P: U1.AM19(MIPI_DPHY_CSI_RX0_D2P) ; off-sheet MIPI_CSI_RX0_D2_P
MIPI_CSI_RX0_D3_N: U1.AL21(MIPI_DPHY_CSI_RX0_D3N) ; off-sheet MIPI_CSI_RX0_D3_N
MIPI_CSI_RX0_D3_P: U1.AL20(MIPI_DPHY_CSI_RX0_D3P) ; off-sheet MIPI_CSI_RX0_D3_P
MIPI_CSI_RX1_CLK0_N: U1.AM31(MIPI_DPHY_CSI_RX1_CLK0N) ; off-sheet MIPI_CSI_RX1_CLK0_N
MIPI_CSI_RX1_CLK0_P: U1.AL31(MIPI_DPHY_CSI_RX1_CLK0P) ; off-sheet MIPI_CSI_RX1_CLK0_P
MIPI_CSI_RX1_D0_N: U1.AJ31(MIPI_DPHY_CSI_RX1_D0N) ; off-sheet MIPI_CSI_RX1_D0_N
MIPI_CSI_RX1_D0_P: U1.AJ32(MIPI_DPHY_CSI_RX1_D0P) ; off-sheet MIPI_CSI_RX1_D0_P
MIPI_CSI_RX1_D1_N: U1.AK32(MIPI_DPHY_CSI_RX1_D1N) ; off-sheet MIPI_CSI_RX1_D1_N
MIPI_CSI_RX1_D1_P: U1.AL32(MIPI_DPHY_CSI_RX1_D1P) ; off-sheet MIPI_CSI_RX1_D1_P
MIPI_CSI_RX1_D2_N: U1.AL28(MIPI_DPHY_CSI_RX1_D2N) ; off-sheet MIPI_CSI_RX1_D2_N
MIPI_CSI_RX1_D2_P: U1.AL27(MIPI_DPHY_CSI_RX1_D2P) ; off-sheet MIPI_CSI_RX1_D2_P
MIPI_CSI_RX1_D3_N: U1.AM29(MIPI_DPHY_CSI_RX1_D3N) ; off-sheet MIPI_CSI_RX1_D3_N
MIPI_CSI_RX1_D3_P: U1.AM28(MIPI_DPHY_CSI_RX1_D3P) ; off-sheet MIPI_CSI_RX1_D3_P
NetR60_1: R60.1 U1.AF31(CAM_CLK1_OUT/UART5_RTSN_M0/GPIO4_B0)
NetR61_1: R61.1 U1.AE31(CAM_CLK0_OUT/UART5_CTSN_M0/GPIO4_B1)

Not connected (* = marked no-connect by the designer): U1 AL22(MIPI_DPHY_CSI_RX0_CLK1P)* AL29(MIPI_DPHY_CSI_RX1_CLK1P)* AL30(MIPI_DPHY_CSI_RX1_CLK1N)* AM22(MIPI_DPHY_CSI_RX0_CLK1N)* T1-21(SPI0_CSN0_M1/SAI1_SDI_M1/PWM0_CH6_M1/UART5_TX_M0/I2C4_SDA_M2/GPIO4_A6)* T1-22(SPI0_CLK_M1/SAI1_SDO_M1/PWM0_CH7_M1/UART5_RX_M0/I2C4_SCL_M2/GPIO4_A7)*

### Layout directives
differential pair; differential pair class CSI_DIFF_100OHM: MIPI_CSI_RX0_CLK0_N, MIPI_CSI_RX0_CLK0_P, MIPI_CSI_RX0_D0_N, MIPI_CSI_RX0_D0_P, MIPI_CSI_RX0_D1_N, MIPI_CSI_RX0_D1_P, MIPI_CSI_RX0_D2_N, MIPI_CSI_RX0_D2_P, MIPI_CSI_RX0_D3_N, MIPI_CSI_RX0_D3_P, MIPI_CSI_RX1_CLK0_N, MIPI_CSI_RX1_CLK0_P, MIPI_CSI_RX1_D0_N, MIPI_CSI_RX1_D0_P, MIPI_CSI_RX1_D1_N, MIPI_CSI_RX1_D1_P, MIPI_CSI_RX1_D2_N, MIPI_CSI_RX1_D2_P, MIPI_CSI_RX1_D3_N, MIPI_CSI_RX1_D3_P
net class CSI_DIFF_CLASS: MIPI_CSI_RX0_CLK0_N, MIPI_CSI_RX0_CLK0_P, MIPI_CSI_RX0_D0_N, MIPI_CSI_RX0_D0_P, MIPI_CSI_RX0_D1_N, MIPI_CSI_RX0_D1_P, MIPI_CSI_RX0_D2_N, MIPI_CSI_RX0_D2_P, MIPI_CSI_RX0_D3_N, MIPI_CSI_RX0_D3_P, MIPI_CSI_RX1_CLK0_N, MIPI_CSI_RX1_CLK0_P, MIPI_CSI_RX1_D0_N, MIPI_CSI_RX1_D0_P, MIPI_CSI_RX1_D1_N, MIPI_CSI_RX1_D1_P, MIPI_CSI_RX1_D2_N, MIPI_CSI_RX1_D2_P, MIPI_CSI_RX1_D3_N, MIPI_CSI_RX1_D3_P

### Notes on the sheet
- Title:
- Drawn By:
- Page Contents:
- Checked By:
- Size:
- Date:
- File:
- License:
- Email:
- A4
- nguyenthanhquoc0206@gmail.com
- Number:
- Time:
- Revision:
- Sheet
- Website:
- of
- https://www.facebook.com/ntq.687
- (in symbol IC_RV1126B_C52941026, part N) MIPI CSI RX0; MIPI CSI RX1
- (in symbol IC_RV1126B_C52941026, part P) SPI/I2C/I2S/UART/CAM CLK

### Library data of the parts
C158-C164 = CAP_100nF-6.3V-10%-0201_1: as C156 on sheet CANFD
R58 R59 = RES_4.7K-50mW-1%-0201: RES 4.7kΩ ±1% 50mW 0201; ComponentLink1Description: LCSC; ComponentLink1URL: https://www.lcsc.com/product-detail/C295718.html?s_z=n_q_t_120%2520OHM&spm=wm.fly.bg.5.xh___wm.ssy.tc.1.tz&lcsc_vid=EwRWBFZSQVIPVFdUTlJfVldeFFRYUFQAElRYBFRRE1MxVlNeRFZeU1BfTlBYVzsOAxUeFF5JWBYZEEoKFBINSQcJGk4eFQsCAgIaSgADAwAHC0slRVhcV1ZTT08GEwkK
R60 R61 = RES_22-50mW-1%-0201: RES 22Ω ±1% 50mW 0201; ComponentLink1Description: LCSC; ComponentLink1URL: https://www.lcsc.com/product-detail/C295718.html?s_z=n_q_t_120%2520OHM&spm=wm.fly.bg.5.xh___wm.ssy.tc.1.tz&lcsc_vid=EwRWBFZSQVIPVFdUTlJfVldeFFRYUFQAElRYBFRRE1MxVlNeRFZeU1BfTlBYVzsOAxUeFF5JWBYZEEoKFBINSQcJGk4eFQsCAgIaSgADAwAHC0slRVhcV1ZTT08GEwkK

## Sheet RGMII.SchDoc: RGMII FOR CPU
size A4; DrawnBy: ThanhQuoc; Revision: V01; SheetNumber: 18; SheetTotal: 21; Project: RV1126 CAMERA BOARD DESIGN; SPICEModelCacheOPRAEGQT: <root> / <DocumentId>OPRAEGQT</DocumentId> / <CacheFrame Number="0"> / <Model Name="fb_220_adv" Kind="CKT"> / <Text>.SUBCKT FB_220_ADV 1 2 / Rdc 1 2 0.045 / * low freq inductive / L1 1 3 50n / R1 3 2 1 / * high freq loss / R2 1 2 200 / Cpar 1 2 2p / .ends FB_220_ADV</Text> / </Model> / </CacheFrame> / </root>
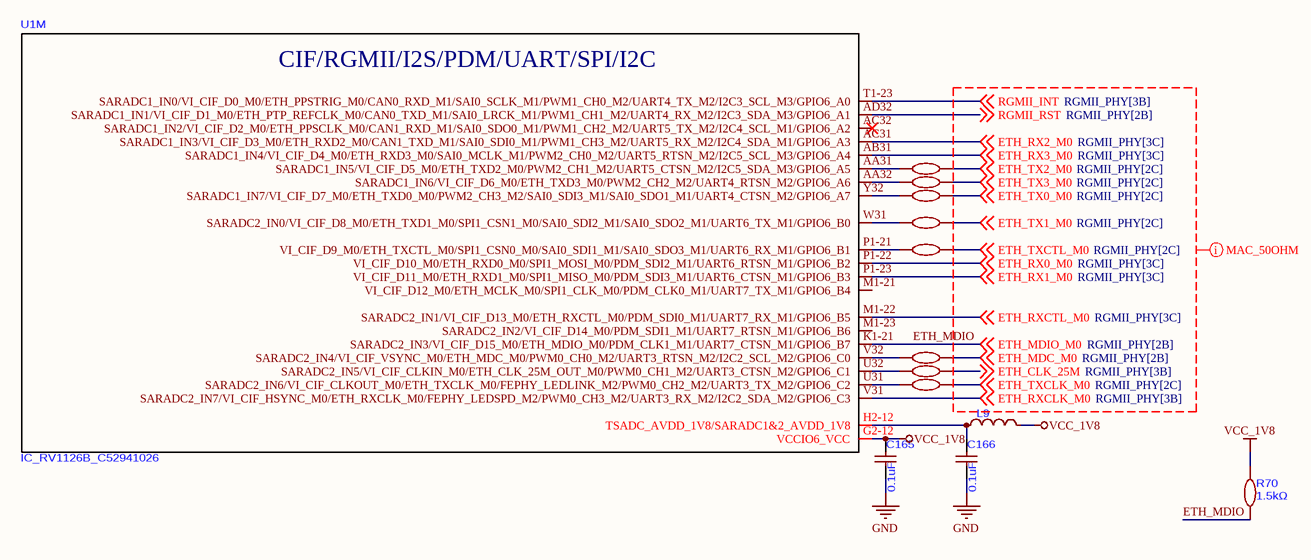
[diagram p17: RGMII.SchDoc]

### Parts
C165  0.1uF  [C0201]
C166  0.1uF  [C0201]
L9  FERRITE BEAD 120Ω 0201 1LN  [R0402]  (value not drawn)
R62  0Ω  [R0201]  (value not drawn)
R63  0Ω  [R0201]  (value not drawn)
R64  0Ω  [R0201]  (value not drawn)
R65  0Ω  [R0201]  (value not drawn)
R66  0Ω  [R0201]  (value not drawn)
R67  0Ω  [R0201]  (value not drawn)
R68  0Ω  [R0201]  (value not drawn)
R69  0Ω  [R0201]  (value not drawn)
R70  1.5kΩ  [R0201]
U1  IC_RV1126B_C52941026  [CCSP-491_L14.0-W14.0-TL_RV1126B]  (part M of 18)

### Nets
GND: C165.1 C166.1
VCC_1V8: C165.2 L9.2 R70.2 U1.G2-12(VCCIO6_VCC)
ETH_CLK_25M: R68.2 ; off-sheet ETH_CLK_25M
ETH_MDC_M0: R67.2 ; off-sheet ETH_MDC_M0
ETH_MDIO: R70.1 U1.K1-21(SARADC2_IN3/VI_CIF_D15_M0/ETH_MDIO_M0/PDM_CLK1_M1/UART7_CTSN_M1/GPIO6_B7) ; off-sheet ETH_MDIO_M0  [also labelled ETH_MDIO_M0]
ETH_RX0_M0: U1.P1-22(VI_CIF_D10_M0/ETH_RXD0_M0/SPI1_MOSI_M0/PDM_SDI2_M1/UART6_RTSN_M1/GPIO6_B2) ; off-sheet ETH_RX0_M0
ETH_RX1_M0: U1.P1-23(VI_CIF_D11_M0/ETH_RXD1_M0/SPI1_MISO_M0/PDM_SDI3_M1/UART6_CTSN_M1/GPIO6_B3) ; off-sheet ETH_RX1_M0
ETH_RX2_M0: U1.AC31(SARADC1_IN3/VI_CIF_D3_M0/ETH_RXD2_M0/CAN1_TXD_M1/SAI0_SDI0_M1/PWM1_CH3_M2/UART5_RX_M2/I2C4_SDA_M1/GPIO6_A3) ; off-sheet ETH_RX2_M0
ETH_RX3_M0: U1.AB31(SARADC1_IN4/VI_CIF_D4_M0/ETH_RXD3_M0/SAI0_MCLK_M1/PWM2_CH0_M2/UART5_RTSN_M2/I2C5_SCL_M3/GPIO6_A4) ; off-sheet ETH_RX3_M0
ETH_RXCLK_M0: U1.V31(SARADC2_IN7/VI_CIF_HSYNC_M0/ETH_RXCLK_M0/FEPHY_LEDSPD_M2/PWM0_CH3_M2/UART3_RX_M2/I2C2_SDA_M2/GPIO6_C3) ; off-sheet ETH_RXCLK_M0
ETH_RXCTL_M0: U1.M1-22(SARADC2_IN1/VI_CIF_D13_M0/ETH_RXCTL_M0/PDM_SDI0_M1/UART7_RX_M1/GPIO6_B5) ; off-sheet ETH_RXCTL_M0
ETH_TX0_M0: R64.2 ; off-sheet ETH_TX0_M0
ETH_TX1_M0: R65.2 ; off-sheet ETH_TX1_M0
ETH_TX2_M0: R62.2 ; off-sheet ETH_TX2_M0
ETH_TX3_M0: R63.2 ; off-sheet ETH_TX3_M0
ETH_TXCLK_M0: R69.2 ; off-sheet ETH_TXCLK_M0
ETH_TXCTL_M0: R66.2 ; off-sheet ETH_TXCTL_M0
RGMII_INT: U1.T1-23(SARADC1_IN0/VI_CIF_D0_M0/ETH_PPSTRIG_M0/CAN0_RXD_M1/SAI0_SCLK_M1/PWM1_CH0_M2/UART4_TX_M2/I2C3_SCL_M3/GPIO6_A0) ; off-sheet RGMII_INT
RGMII_RST: U1.AD32(SARADC1_IN1/VI_CIF_D1_M0/ETH_PTP_REFCLK_M0/CAN0_TXD_M1/SAI0_LRCK_M1/PWM1_CH1_M2/UART4_RX_M2/I2C3_SDA_M3/GPIO6_A1) ; off-sheet RGMII_RST  [project net RSTB]
NetC166_2: C166.2 L9.1 U1.H2-12(TSADC_AVDD_1V8/SARADC1&2_AVDD_1V8)
NetR62_1: R62.1 U1.AA31(SARADC1_IN5/VI_CIF_D5_M0/ETH_TXD2_M0/PWM2_CH1_M2/UART5_CTSN_M2/I2C5_SDA_M3/GPIO6_A5)
NetR63_1: R63.1 U1.AA32(SARADC1_IN6/VI_CIF_D6_M0/ETH_TXD3_M0/PWM2_CH2_M2/UART4_RTSN_M2/GPIO6_A6)
NetR64_1: R64.1 U1.Y32(SARADC1_IN7/VI_CIF_D7_M0/ETH_TXD0_M0/PWM2_CH3_M2/SAI0_SDI3_M1/SAI0_SDO1_M1/UART4_CTSN_M2/GPIO6_A7)
NetR65_1: R65.1 U1.W31(SARADC2_IN0/VI_CIF_D8_M0/ETH_TXD1_M0/SPI1_CSN1_M0/SAI0_SDI2_M1/SAI0_SDO2_M1/UART6_TX_M1/GPIO6_B0)
NetR66_1: R66.1 U1.P1-21(VI_CIF_D9_M0/ETH_TXCTL_M0/SPI1_CSN0_M0/SAI0_SDI1_M1/SAI0_SDO3_M1/UART6_RX_M1/GPIO6_B1)
NetR67_1: R67.1 U1.V32(SARADC2_IN4/VI_CIF_VSYNC_M0/ETH_MDC_M0/PWM0_CH0_M2/UART3_RTSN_M2/I2C2_SCL_M2/GPIO6_C0)
NetR68_1: R68.1 U1.U32(SARADC2_IN5/VI_CIF_CLKIN_M0/ETH_CLK_25M_OUT_M0/PWM0_CH1_M2/UART3_CTSN_M2/GPIO6_C1)
NetR69_1: R69.1 U1.U31(SARADC2_IN6/VI_CIF_CLKOUT_M0/ETH_TXCLK_M0/FEPHY_LEDLINK_M2/PWM0_CH2_M2/UART3_TX_M2/GPIO6_C2)

Not connected (* = marked no-connect by the designer): U1 AC32(SARADC1_IN2/VI_CIF_D2_M0/ETH_PPSCLK_M0/CAN1_RXD_M1/SAI0_SDO0_M1/PWM1_CH2_M2/UART5_TX_M2/I2C4_SCL_M1/GPIO6_A2)* M1-21(VI_CIF_D12_M0/ETH_MCLK_M0/SPI1_CLK_M0/PDM_CLK0_M1/UART7_TX_M1/GPIO6_B4) M1-23(SARADC2_IN2/VI_CIF_D14_M0/PDM_SDI1_M1/UART7_RTSN_M1/GPIO6_B6)

### Layout directives
net class MAC_50OHM: ETH_CLK_25M, ETH_MDC_M0, ETH_MDIO_M0, ETH_RX0_M0, ETH_RX1_M0, ETH_RX2_M0, ETH_RX3_M0, ETH_RXCLK_M0, ETH_RXCTL_M0, ETH_TX0_M0, ETH_TX1_M0, ETH_TX2_M0, ETH_TX3_M0, ETH_TXCLK_M0, ETH_TXCTL_M0, RGMII_INT, RGMII_RST

### Notes on the sheet
- Title:
- Drawn By:
- Page Contents:
- Checked By:
- Size:
- Date:
- File:
- License:
- Email:
- A4
- nguyenthanhquoc0206@gmail.com
- Number:
- Time:
- Revision:
- Sheet
- Website:
- of
- https://www.facebook.com/ntq.687
- (in symbol IC_RV1126B_C52941026, part M) CIF/RGMII/I2S/PDM/UART/SPI/I2C

### Library data of the parts
C165 C166 = CAP_100nF-6.3V-10%-0201_1: as C156 on sheet CANFD
L9 = MPZ0603S121HT000: 120 Ohms @ 100MHz 1 Power Line Ferrite Bead 0201 1A 130mOhm
R62-R69 = RES_0OHM-50mW-1%-0201: RES 0Ω ±1% 50mW 0201; ComponentLink1Description: LCSC; ComponentLink1URL: https://www.lcsc.com/product-detail/C295718.html?s_z=n_q_t_120%2520OHM&spm=wm.fly.bg.5.xh___wm.ssy.tc.1.tz&lcsc_vid=EwRWBFZSQVIPVFdUTlJfVldeFFRYUFQAElRYBFRRE1MxVlNeRFZeU1BfTlBYVzsOAxUeFF5JWBYZEEoKFBINSQcJGk4eFQsCAgIaSgADAwAHC0slRVhcV1ZTT08GEwkK
R70 = RES_1.5K-0.05W-1%-0201: RES 1500Ω ±1% 0.05W 0201; ComponentLink1Description: LCSC; ComponentLink1URL: https://www.lcsc.com/product-detail/C93949.html?spm=wm.fly.bg.0.xh&lcsc_vid=EwRWBFZSQVIPVFdUTlJfVldeFFRYUFQAElRYBFRRE1MxVlNeRVlXUFNQQ1RWXjsOAxUeFF5JWBYZEEoKFBINSQcJGk4eFQsCAgIaSgADAwAHC0slRlVYUFFIHxUDCw%3D%3D

## Sheet RGMII_PHY.SchDoc: RGMII PHY
size A4; DrawnBy: ThanhQuoc; Revision: V01; SheetNumber: 19; SheetTotal: 21; Project: RV1126 CAMERA BOARD DESIGN; SPICEModelCachePFUVNJYO: <root> / <DocumentId>PFUVNJYO</DocumentId> / <CacheFrame Number="0"> / <Model Name="fb_220_adv" Kind="CKT"> / <Text>.SUBCKT FB_220_ADV 1 2 / Rdc 1 2 0.045 / * low freq inductive / L1 1 3 50n / R1 3 2 1 / * high freq loss / R2 1 2 200 / Cpar 1 2 2p / .ends FB_220_ADV</Text> / </Model> / </CacheFrame> / </root>
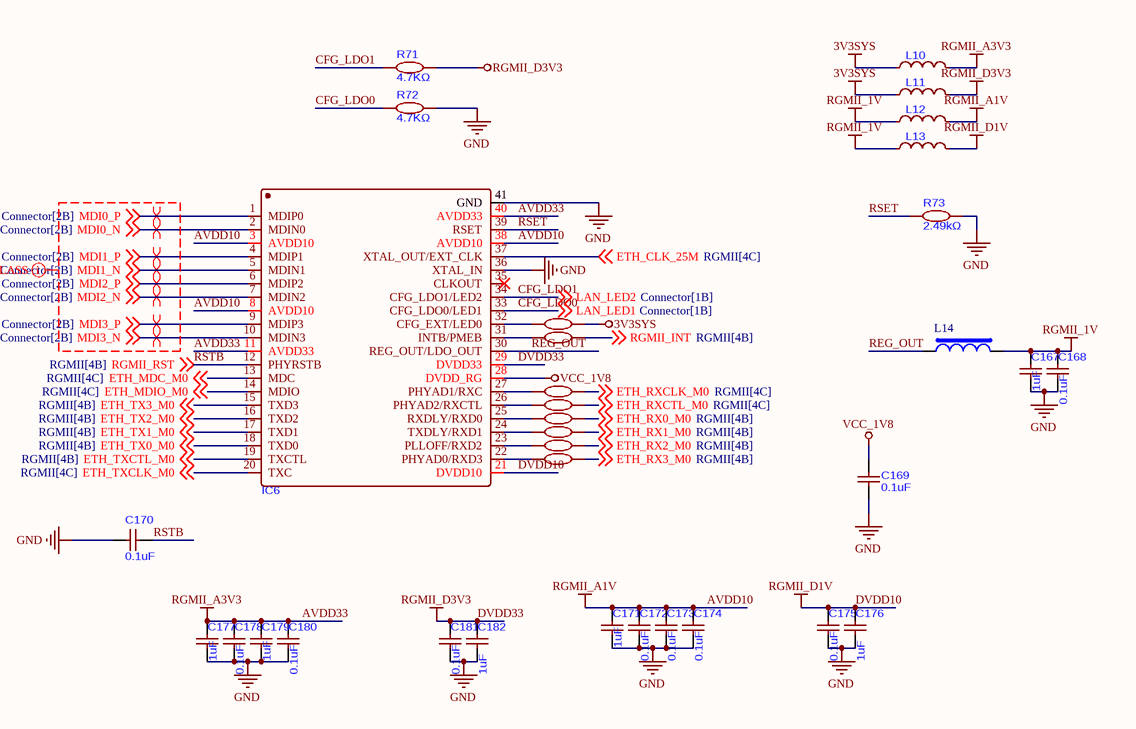
[diagram p18: RGMII_PHY.SchDoc]

### Parts
C167  1uF  [C0201]
C168  0.1uF  [C0201]
C169  0.1uF  [C0201]
C170  0.1uF  [C0201]
C171  1uF  [C0201]
C172  0.1uF  [C0201]
C173  0.1uF  [C0201]
C174  0.1uF  [C0201]
C175  0.1uF  [C0201]
C176  1uF  [C0201]
C177  1uF  [C0201]
C178  0.1uF  [C0201]
C179  1uF  [C0201]
C180  0.1uF  [C0201]
C181  0.1uF  [C0201]
C182  1uF  [C0201]
IC6  RTL8211F-CG  [WQFN-40_L5.0-W5.0-P0.4-BL-EP]  (value not drawn)
L10  FERRITE BEAD 120Ω 0201 1LN  [R0201]  (value not drawn)
L11  FERRITE BEAD 120Ω 0201 1LN  [R0201]  (value not drawn)
L12  FERRITE BEAD 120Ω 0201 1LN  [R0201]  (value not drawn)
L13  FERRITE BEAD 120Ω 0201 1LN  [R0201]  (value not drawn)
L14  PSTMAA252012-2R2MB  [IND_1008]  (value not drawn)
R71  4.7KΩ  [R0201]
R72  4.7KΩ  [R0201]
R73  2.49kΩ  [R0201]
R74  4.7KΩ  [R0201]  (value not drawn)
R75  0Ω  [R0201]  (value not drawn)
R76  22Ω  [R0201]  (value not drawn)
R77  22Ω  [R0201]  (value not drawn)
R78  22Ω  [R0201]  (value not drawn)
R79  22Ω  [R0201]  (value not drawn)
R80  22Ω  [R0201]  (value not drawn)
R81  22Ω  [R0201]  (value not drawn)

### Nets
3V3SYS: L10.1 L11.1 R74.2
AVDD10: C171.2 C172.2 C173.2 C174.2 IC6.3(AVDD10) IC6.8(AVDD10) IC6.38(AVDD10) L12.2  [also labelled RGMII_A1V]
AVDD33: C177.2 C178.2 C179.2 C180.2 IC6.11(AVDD33) IC6.40(AVDD33) L10.2  [also labelled RGMII_A3V3]
DVDD10: C175.2 C176.2 IC6.21(DVDD10) L13.2  [also labelled RGMII_D1V]
DVDD33: C181.2 C182.2 IC6.29(DVDD33) L11.2 R71.1  [also labelled RGMII_D3V3]
GND: C167.1 C168.1 C169.1 C170.2 C171.1 C172.1 C173.1 C174.1 C175.1 C176.1 C177.1 C178.1 C179.1 C180.1 C181.1 C182.1 IC6.36(XTAL_IN) IC6.41(GND) R72.1 R73.2
RGMII_1V: C167.2 C168.2 L12.1 L13.1 L14.2
VCC_1V8: C169.2 IC6.28(DVDD_RG)
CFG_LDO0: IC6.33(CFG_LDO0/LED1) R72.2 ; off-sheet LAN_LED1  [also labelled LAN_LED1]
CFG_LDO1: IC6.34(CFG_LDO1/LED2) R71.2 ; off-sheet LAN_LED2  [also labelled LAN_LED2]
ETH_CLK_25M: IC6.37(XTAL_OUT/EXT_CLK) ; off-sheet ETH_CLK_25M
ETH_MDC_M0: IC6.13(MDC) ; off-sheet ETH_MDC_M0
ETH_MDIO_M0: IC6.14(MDIO) ; off-sheet ETH_MDIO_M0  [project net ETH_MDIO]
ETH_RX0_M0: R78.2 ; off-sheet ETH_RX0_M0
ETH_RX1_M0: R79.2 ; off-sheet ETH_RX1_M0
ETH_RX2_M0: R80.2 ; off-sheet ETH_RX2_M0
ETH_RX3_M0: R81.2 ; off-sheet ETH_RX3_M0
ETH_RXCLK_M0: R76.2 ; off-sheet ETH_RXCLK_M0
ETH_RXCTL_M0: R77.2 ; off-sheet ETH_RXCTL_M0
ETH_TX0_M0: IC6.18(TXD0) ; off-sheet ETH_TX0_M0
ETH_TX1_M0: IC6.17(TXD1) ; off-sheet ETH_TX1_M0
ETH_TX2_M0: IC6.16(TXD2) ; off-sheet ETH_TX2_M0
ETH_TX3_M0: IC6.15(TXD3) ; off-sheet ETH_TX3_M0
ETH_TXCLK_M0: IC6.20(TXC) ; off-sheet ETH_TXCLK_M0
ETH_TXCTL_M0: IC6.19(TXCTL) ; off-sheet ETH_TXCTL_M0
MDI0_N: IC6.2(MDIN0) ; off-sheet MDI0_N
MDI0_P: IC6.1(MDIP0) ; off-sheet MDI0_P
MDI1_N: IC6.5(MDIN1) ; off-sheet MDI1_N
MDI1_P: IC6.4(MDIP1) ; off-sheet MDI1_P
MDI2_N: IC6.7(MDIN2) ; off-sheet MDI2_N
MDI2_P: IC6.6(MDIP2) ; off-sheet MDI2_P
MDI3_N: IC6.10(MDIN3) ; off-sheet MDI3_N
MDI3_P: IC6.9(MDIP3) ; off-sheet MDI3_P
REG_OUT: IC6.30(REG_OUT/LDO_OUT) L14.1
RGMII_INT: R75.2 ; off-sheet RGMII_INT
RSET: IC6.39(RSET) R73.1
RSTB: C170.1 IC6.12(PHYRSTB) ; off-sheet RGMII_RST  [also labelled RGMII_RST]
NetIC6_22: IC6.22(PHYAD0/RXD3) R81.1
NetIC6_23: IC6.23(PLLOFF/RXD2) R80.1
NetIC6_24: IC6.24(TXDLY/RXD1) R79.1
NetIC6_25: IC6.25(RXDLY/RXD0) R78.1
NetIC6_26: IC6.26(PHYAD2/RXCTL) R77.1
NetIC6_27: IC6.27(PHYAD1/RXC) R76.1
NetIC6_31: IC6.31(INTB/PMEB) R75.1
NetIC6_32: IC6.32(CFG_EXT/LED0) R74.1

Not connected (* = marked no-connect by the designer): IC6 35(CLKOUT)*

### Layout directives
mark named DIFF_PHY_CLASS: MDI0_N, MDI0_P, MDI1_N, MDI1_P, MDI2_N, MDI2_P, MDI3_N, MDI3_P
differential pair; differential pair class PHY_DIFF_100: MDI0_N, MDI0_P, MDI1_N, MDI1_P, MDI2_N, MDI2_P, MDI3_N, MDI3_P

### Notes on the sheet
- Title:
- Drawn By:
- Page Contents:
- Checked By:
- Size:
- Date:
- File:
- License:
- Email:
- A4
- nguyenthanhquoc0206@gmail.com
- Number:
- Time:
- Revision:
- Sheet
- Website:
- of
- https://www.facebook.com/ntq.687

### Library data of the parts
C167 C171 C176 C177 C179 C182 = CAP_1uF-6.3V-10%-0201: 1uF ±10% 6.3V Ceramic Capacitor X5R 0201
C168-C170 C172-C175 C178 C180 C181 = CAP_100nF-6.3V-10%-0201_1: as C156 on sheet CANFD
IC6 = RTL8211F-CG: Integrated 10/100/1000M Ethernet Precision Transceiver
L10-L13 = MPZ0603S121HT000: as L9 on sheet RGMII
L14 = IND_2.2uH-4.1A-20%-1008: 2.2uH Shielded Wirewound Inductor 4.1A 60mOhm Max 1008 (2520 Metric); Manufacturer: Murata Electronics; Manufacturer Part Number: DFE252010P-R47M=P2; Case/Package: 1008; Supplier-1: Digikey
R71 R72 R74 = RES_4.7K-50mW-1%-0201: RES 4.7kΩ ±1% 50mW 0201; ComponentLink1Description: LCSC; ComponentLink1URL: https://www.lcsc.com/product-detail/C295718.html?s_z=n_q_t_120%2520OHM&spm=wm.fly.bg.5.xh___wm.ssy.tc.1.tz&lcsc_vid=EwRWBFZSQVIPVFdUTlJfVldeFFRYUFQAElRYBFRRE1MxVlNeRFZeU1BfTlBYVzsOAxUeFF5JWBYZEEoKFBINSQcJGk4eFQsCAgIaSgADAwAHC0slRVhcV1ZTT08GEwkK
R73 = RES_2.49K-0.05W-1%-0201: RES 2.49kΩ ±1% 50mW 0201; ComponentLink1Description: LCSC; ComponentLink1URL: https://www.lcsc.com/product-detail/C320826.html?spm=wm.fly.bg.3.xh&lcsc_vid=EwRWBFZSQVIPVFdUTlJfVldeFFRYUFQAElRYBFRRE1MxVlNeRFdcXlNfT1JZVDsOAxUeFF5JWBYZEEoKFBINSQcJGk4eFQsCAgIaSgADAwAHC0slRlRbUFBVWQkaCgg%3D
R75 = RES_0OHM-50mW-1%-0201: RES 0Ω ±1% 50mW 0201; ComponentLink1Description: LCSC; ComponentLink1URL: https://www.lcsc.com/product-detail/C295718.html?s_z=n_q_t_120%2520OHM&spm=wm.fly.bg.5.xh___wm.ssy.tc.1.tz&lcsc_vid=EwRWBFZSQVIPVFdUTlJfVldeFFRYUFQAElRYBFRRE1MxVlNeRFZeU1BfTlBYVzsOAxUeFF5JWBYZEEoKFBINSQcJGk4eFQsCAgIaSgADAwAHC0slRVhcV1ZTT08GEwkK
R76-R81 = RES_22-50mW-1%-0201: RES 22Ω ±1% 50mW 0201; ComponentLink1Description: LCSC; ComponentLink1URL: https://www.lcsc.com/product-detail/C295718.html?s_z=n_q_t_120%2520OHM&spm=wm.fly.bg.5.xh___wm.ssy.tc.1.tz&lcsc_vid=EwRWBFZSQVIPVFdUTlJfVldeFFRYUFQAElRYBFRRE1MxVlNeRFZeU1BfTlBYVzsOAxUeFF5JWBYZEEoKFBINSQcJGk4eFQsCAgIaSgADAwAHC0slRVhcV1ZTT08GEwkK

## Sheet Connector.SchDoc: CONNECTOR
size A4; DrawnBy: ThanhQuoc; Revision: V01; SheetNumber: 20; SheetTotal: 21; Project: RV1126 CAMERA BOARD DESIGN
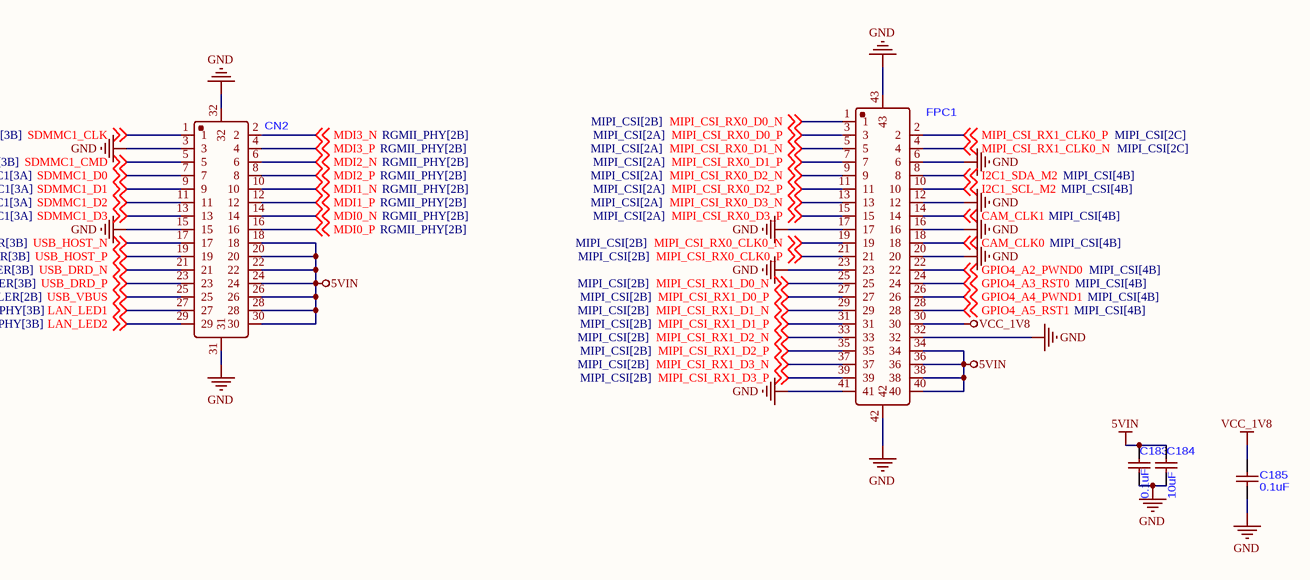
[diagram p19: Connector.SchDoc]

### Parts
C183  0.1uF  [C0201]
C184  10uF  [C0402]
C185  0.1uF  [C0201]
CN2  DF12NB(3.0)-30DP-0.5V(51)  [CONN-SMD_30P-P0.50_HRS_DF12NB-3.0-30DP-0.5V]  (value not drawn)
FPC1  FH35C-41S-0.3SHW(50)  [FPC-SMD_FH35C-41S-0.3SHW-50]  (value not drawn)

### Nets
5VIN: C183.2 C184.2 CN2.18 CN2.20 CN2.22 CN2.24 CN2.26 CN2.28 CN2.30 FPC1.34 FPC1.36 FPC1.38 FPC1.40
GND: C183.1 C184.1 C185.1 CN2.3 CN2.15 CN2.31 CN2.32 FPC1.6 FPC1.12 FPC1.16 FPC1.17 FPC1.20 FPC1.23 FPC1.32 FPC1.41 FPC1.42 FPC1.43
VCC_1V8: C185.2 FPC1.30
CAM_CLK0: FPC1.18 ; off-sheet CAM_CLK0
CAM_CLK1: FPC1.14 ; off-sheet CAM_CLK1
GPIO4_A2_PWND0: FPC1.22 ; off-sheet GPIO4_A2_PWND0
GPIO4_A3_RST0: FPC1.24 ; off-sheet GPIO4_A3_RST0
GPIO4_A4_PWND1: FPC1.26 ; off-sheet GPIO4_A4_PWND1
GPIO4_A5_RST1: FPC1.28 ; off-sheet GPIO4_A5_RST1
I2C1_SCL_M2: FPC1.10 ; off-sheet I2C1_SCL_M2
I2C1_SDA_M2: FPC1.8 ; off-sheet I2C1_SDA_M2
LAN_LED1: CN2.27 ; off-sheet LAN_LED1  [project net CFG_LDO0]
LAN_LED2: CN2.29 ; off-sheet LAN_LED2  [project net CFG_LDO1]
MDI0_N: CN2.14 ; off-sheet MDI0_N
MDI0_P: CN2.16 ; off-sheet MDI0_P
MDI1_N: CN2.10 ; off-sheet MDI1_N
MDI1_P: CN2.12 ; off-sheet MDI1_P
MDI2_N: CN2.6 ; off-sheet MDI2_N
MDI2_P: CN2.8 ; off-sheet MDI2_P
MDI3_N: CN2.2 ; off-sheet MDI3_N
MDI3_P: CN2.4 ; off-sheet MDI3_P
MIPI_CSI_RX0_CLK0_N: FPC1.19 ; off-sheet MIPI_CSI_RX0_CLK0_N
MIPI_CSI_RX0_CLK0_P: FPC1.21 ; off-sheet MIPI_CSI_RX0_CLK0_P
MIPI_CSI_RX0_D0_N: FPC1.1 ; off-sheet MIPI_CSI_RX0_D0_N
MIPI_CSI_RX0_D0_P: FPC1.3 ; off-sheet MIPI_CSI_RX0_D0_P
MIPI_CSI_RX0_D1_N: FPC1.5 ; off-sheet MIPI_CSI_RX0_D1_N
MIPI_CSI_RX0_D1_P: FPC1.7 ; off-sheet MIPI_CSI_RX0_D1_P
MIPI_CSI_RX0_D2_N: FPC1.9 ; off-sheet MIPI_CSI_RX0_D2_N
MIPI_CSI_RX0_D2_P: FPC1.11 ; off-sheet MIPI_CSI_RX0_D2_P
MIPI_CSI_RX0_D3_N: FPC1.13 ; off-sheet MIPI_CSI_RX0_D3_N
MIPI_CSI_RX0_D3_P: FPC1.15 ; off-sheet MIPI_CSI_RX0_D3_P
MIPI_CSI_RX1_CLK0_N: FPC1.4 ; off-sheet MIPI_CSI_RX1_CLK0_N
MIPI_CSI_RX1_CLK0_P: FPC1.2 ; off-sheet MIPI_CSI_RX1_CLK0_P
MIPI_CSI_RX1_D0_N: FPC1.25 ; off-sheet MIPI_CSI_RX1_D0_N
MIPI_CSI_RX1_D0_P: FPC1.27 ; off-sheet MIPI_CSI_RX1_D0_P
MIPI_CSI_RX1_D1_N: FPC1.29 ; off-sheet MIPI_CSI_RX1_D1_N
MIPI_CSI_RX1_D1_P: FPC1.31 ; off-sheet MIPI_CSI_RX1_D1_P
MIPI_CSI_RX1_D2_N: FPC1.33 ; off-sheet MIPI_CSI_RX1_D2_N
MIPI_CSI_RX1_D2_P: FPC1.35 ; off-sheet MIPI_CSI_RX1_D2_P
MIPI_CSI_RX1_D3_N: FPC1.37 ; off-sheet MIPI_CSI_RX1_D3_N
MIPI_CSI_RX1_D3_P: FPC1.39 ; off-sheet MIPI_CSI_RX1_D3_P
SDMMC1_CLK: CN2.1 ; off-sheet SDMMC1_CLK
SDMMC1_CMD: CN2.5 ; off-sheet SDMMC1_CMD
SDMMC1_D0: CN2.7 ; off-sheet SDMMC1_D0
SDMMC1_D1: CN2.9 ; off-sheet SDMMC1_D1
SDMMC1_D2: CN2.11 ; off-sheet SDMMC1_D2
SDMMC1_D3: CN2.13 ; off-sheet SDMMC1_D3
USB_DRD_N: CN2.21 ; off-sheet USB_DRD_N
USB_DRD_P: CN2.23 ; off-sheet USB_DRD_P
USB_HOST_N: CN2.17 ; off-sheet USB_HOST_N
USB_HOST_P: CN2.19 ; off-sheet USB_HOST_P
USB_VBUS: CN2.25 ; off-sheet USB_VBUS

### Notes on the sheet
- Title:
- Drawn By:
- Page Contents:
- Checked By:
- Size:
- Date:
- File:
- License:
- Email:
- A4
- nguyenthanhquoc0206@gmail.com
- Number:
- Time:
- Revision:
- Sheet
- Website:
- of
- https://www.facebook.com/ntq.687

### Library data of the parts
C183 C185 = CAP_100nF-6.3V-10%-0201_1: as C156 on sheet CANFD
C184 = CAP_10uF-10V-20%-0402: 10µF ±20% 10V Ceramic Capacitor X5R 0402 (1005 Metric)
CN2 = DF12NB(3.0)-30DP-0.5V(51): 0.5mm Pitch SMT Board-to-Board Connectors, 5Gbps Transmission Speed
FPC1 = FH35C-41S-0.3SHW(50): CONN FFC FPC 41POS 0.3mm TOP AND BOTTOM CNT SMD R/A

## Sheet OTHER.SchDoc: OTHER
size A4; DrawnBy: ThanhQuoc; Revision: V01; SheetNumber: 21; SheetTotal: 21; Project: RV1126 CAMERA BOARD DESIGN
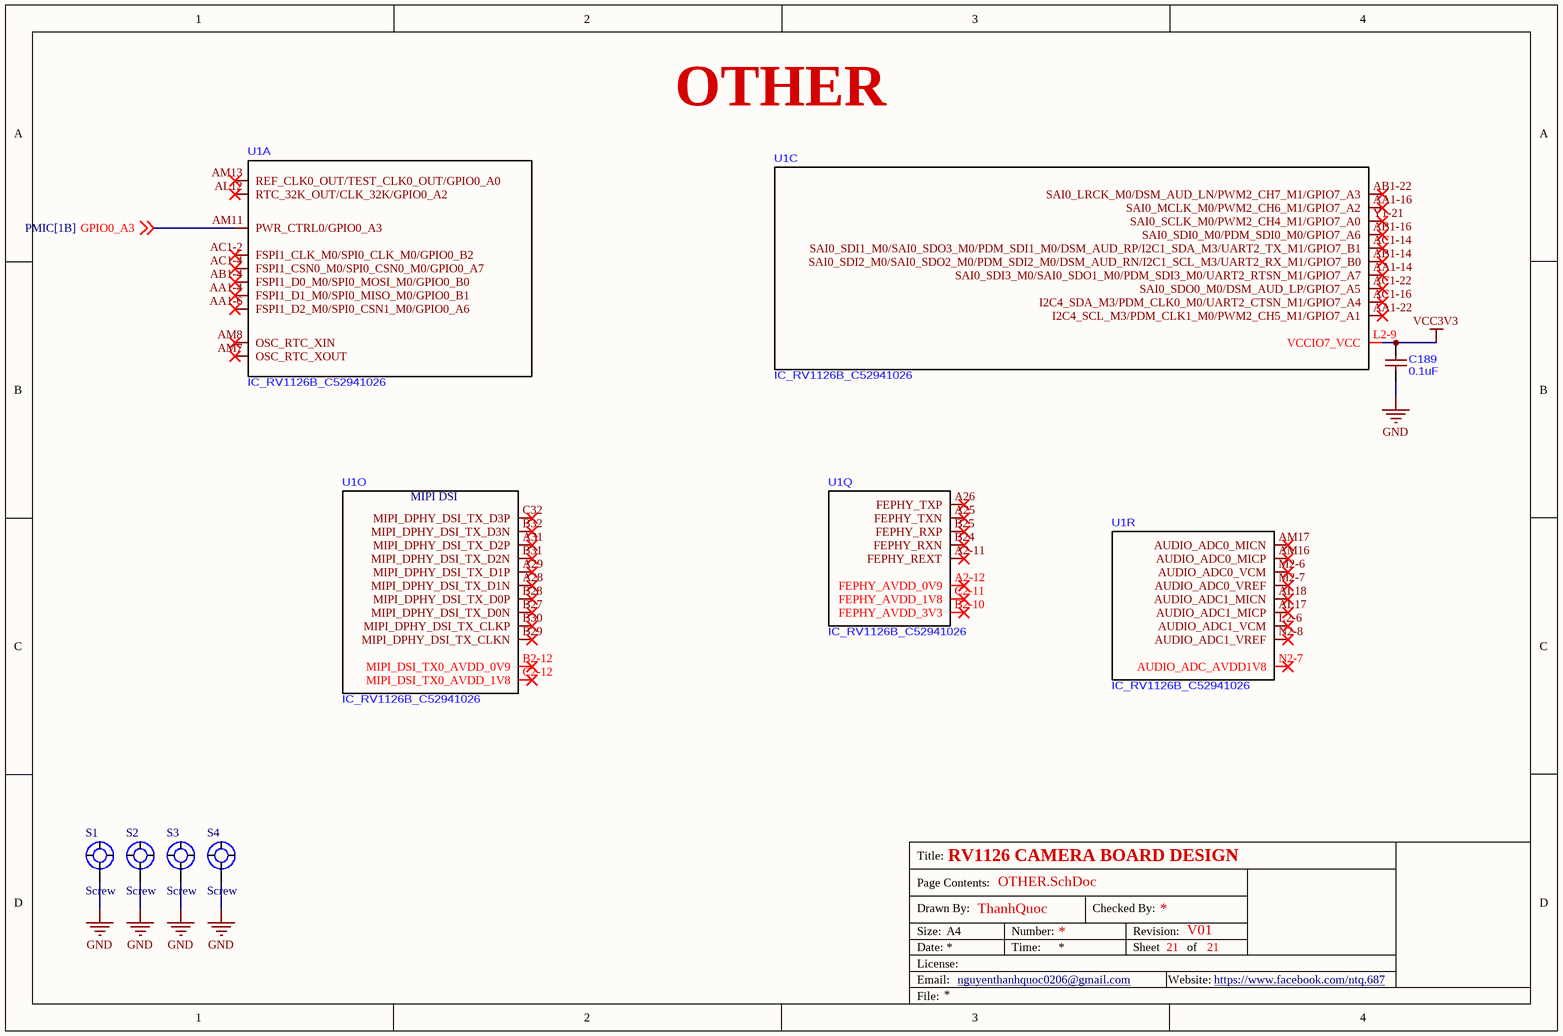
[diagram p20: OTHER.SchDoc]

### Parts
C189  0.1uF  [C0201]
S1  Screw  [SCREW 3.0]
S2  Screw  [SCREW 3.0]
S3  Screw  [SCREW 3.0]
S4  Screw  [SCREW 3.0]
U1  IC_RV1126B_C52941026  [CCSP-491_L14.0-W14.0-TL_RV1126B]  (parts A,C,O,Q,R of 18)

### Nets
GND: C189.1 S1.1 S2.1 S3.1 S4.1
VCC3V3: C189.2 U1.L2-9(VCCIO7_VCC)
GPIO0_A3: U1.AM11(PWR_CTRL0/GPIO0_A3) ; off-sheet GPIO0_A3

Not connected (* = marked no-connect by the designer): U1 A2-11(FEPHY_REXT)* A2-12(FEPHY_AVDD_0V9)* A25(FEPHY_TXN)* A26(FEPHY_TXP)* A28(MIPI_DPHY_DSI_TX_D1N)* A29(MIPI_DPHY_DSI_TX_D1P)* A31(MIPI_DPHY_DSI_TX_D2P)* AA1-4(FSPI1_D1_M0/SPI0_MISO_M0/GPIO0_B1)* AA1-6(FSPI1_D2_M0/SPI0_CSN1_M0/GPIO0_A6)* AA1-14(SAI0_SDI3_M0/SAI0_SDO1_M0/PDM_SDI3_M0/UART2_RTSN_M1/GPIO7_A7)* AA1-16(SAI0_MCLK_M0/PWM2_CH6_M1/GPIO7_A2)* AA1-22(I2C4_SCL_M3/PDM_CLK1_M0/PWM2_CH5_M1/GPIO7_A1)* AB1-4(FSPI1_D0_M0/SPI0_MOSI_M0/GPIO0_B0)* AB1-14(SAI0_SDI2_M0/SAI0_SDO2_M0/PDM_SDI2_M0/DSM_AUD_RN/I2C1_SCL_M3/UART2_RX_M1/GPIO7_B0)* AB1-16(SAI0_SDI0_M0/PDM_SDI0_M0/GPIO7_A6)* AB1-22(SAI0_LRCK_M0/DSM_AUD_LN/PWM2_CH7_M1/GPIO7_A3)* AC1-2(FSPI1_CLK_M0/SPI0_CLK_M0/GPIO0_B2)* AC1-4(FSPI1_CSN0_M0/SPI0_CSN0_M0/GPIO0_A7)* AC1-14(SAI0_SDI1_M0/SAI0_SDO3_M0/PDM_SDI1_M0/DSM_AUD_RP/I2C1_SDA_M3/UART2_TX_M1/GPIO7_B1)* AC1-16(I2C4_SDA_M3/PDM_CLK0_M0/UART2_CTSN_M1/GPIO7_A4)* AC1-22(SAI0_SDO0_M0/DSM_AUD_LP/GPIO7_A5)* AL12(RTC_32K_OUT/CLK_32K/GPIO0_A2)* AL17(AUDIO_ADC1_MICP)* AL18(AUDIO_ADC1_MICN)* AM7(OSC_RTC_XOUT)* AM8(OSC_RTC_XIN)* AM13(REF_CLK0_OUT/TEST_CLK0_OUT/GPIO0_A0)* AM16(AUDIO_ADC0_MICP)* AM17(AUDIO_ADC0_MICN)* B2-10(FEPHY_AVDD_3V3)* B2-12(MIPI_DSI_TX0_AVDD_0V9)* B24(FEPHY_RXN)* B25(FEPHY_RXP)* B27(MIPI_DPHY_DSI_TX_D0N)* B28(MIPI_DPHY_DSI_TX_D0P)* B29(MIPI_DPHY_DSI_TX_CLKN)* B30(MIPI_DPHY_DSI_TX_CLKP)* B31(MIPI_DPHY_DSI_TX_D2N)* B32(MIPI_DPHY_DSI_TX_D3N)* C2-11(FEPHY_AVDD_1V8)* C2-12(MIPI_DSI_TX0_AVDD_1V8)* C32(MIPI_DPHY_DSI_TX_D3P)* L2-6(AUDIO_ADC1_VCM)* M2-6(AUDIO_ADC0_VCM)* M2-7(AUDIO_ADC0_VREF)* N2-7(AUDIO_ADC_AVDD1V8)* N2-8(AUDIO_ADC1_VREF)* Y1-21(SAI0_SCLK_M0/PWM2_CH4_M1/GPIO7_A0)*

### Notes on the sheet
- Title:
- Drawn By:
- Page Contents:
- Checked By:
- Size:
- Date:
- File:
- License:
- Email:
- A4
- nguyenthanhquoc0206@gmail.com
- Number:
- Time:
- Revision:
- Sheet
- Website:
- of
- https://www.facebook.com/ntq.687
- (in symbol IC_RV1126B_C52941026, part O) MIPI DSI

### Library data of the parts
C189 = CAP_100nF-6.3V-10%-0201_1: as C156 on sheet CANFD